# EasyEDA Pro project 主控底板.eprj

# Schematic TMS320F28335

## Sheets
1 coreboard: Board Name: TMS320F28335
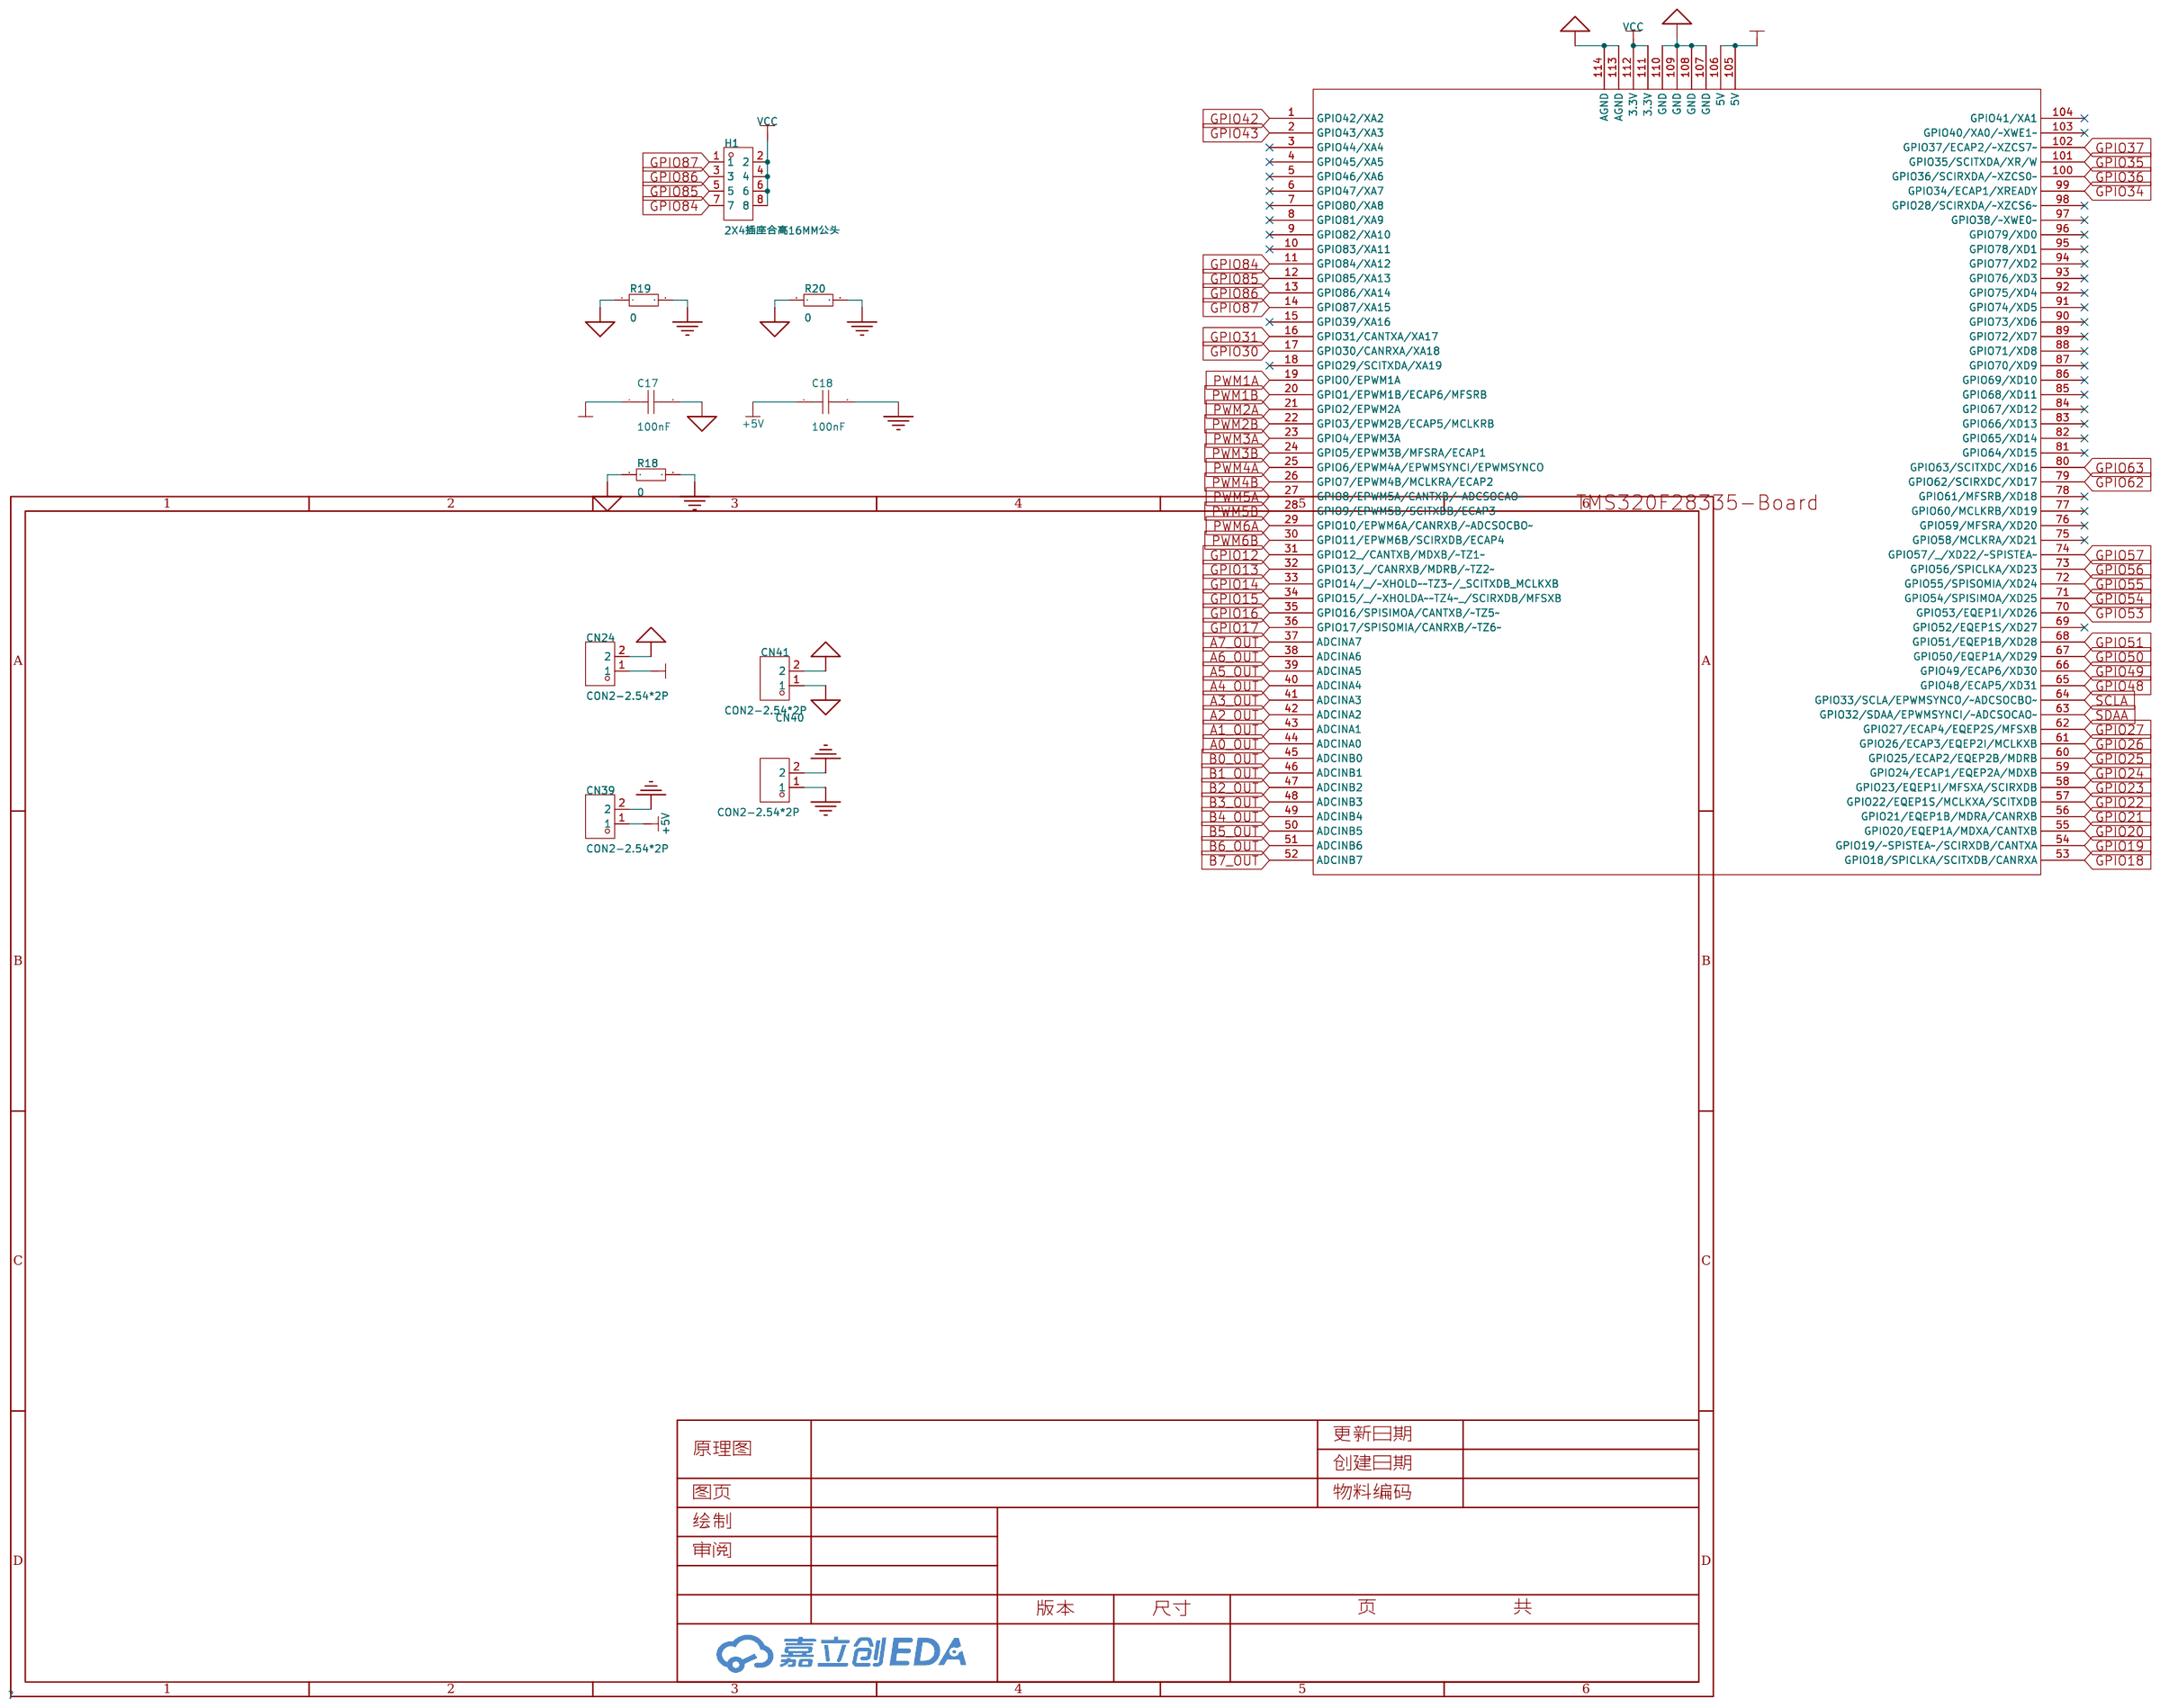
[diagram p0: coreboard]
2 adc: Create Date: 2025-05-22
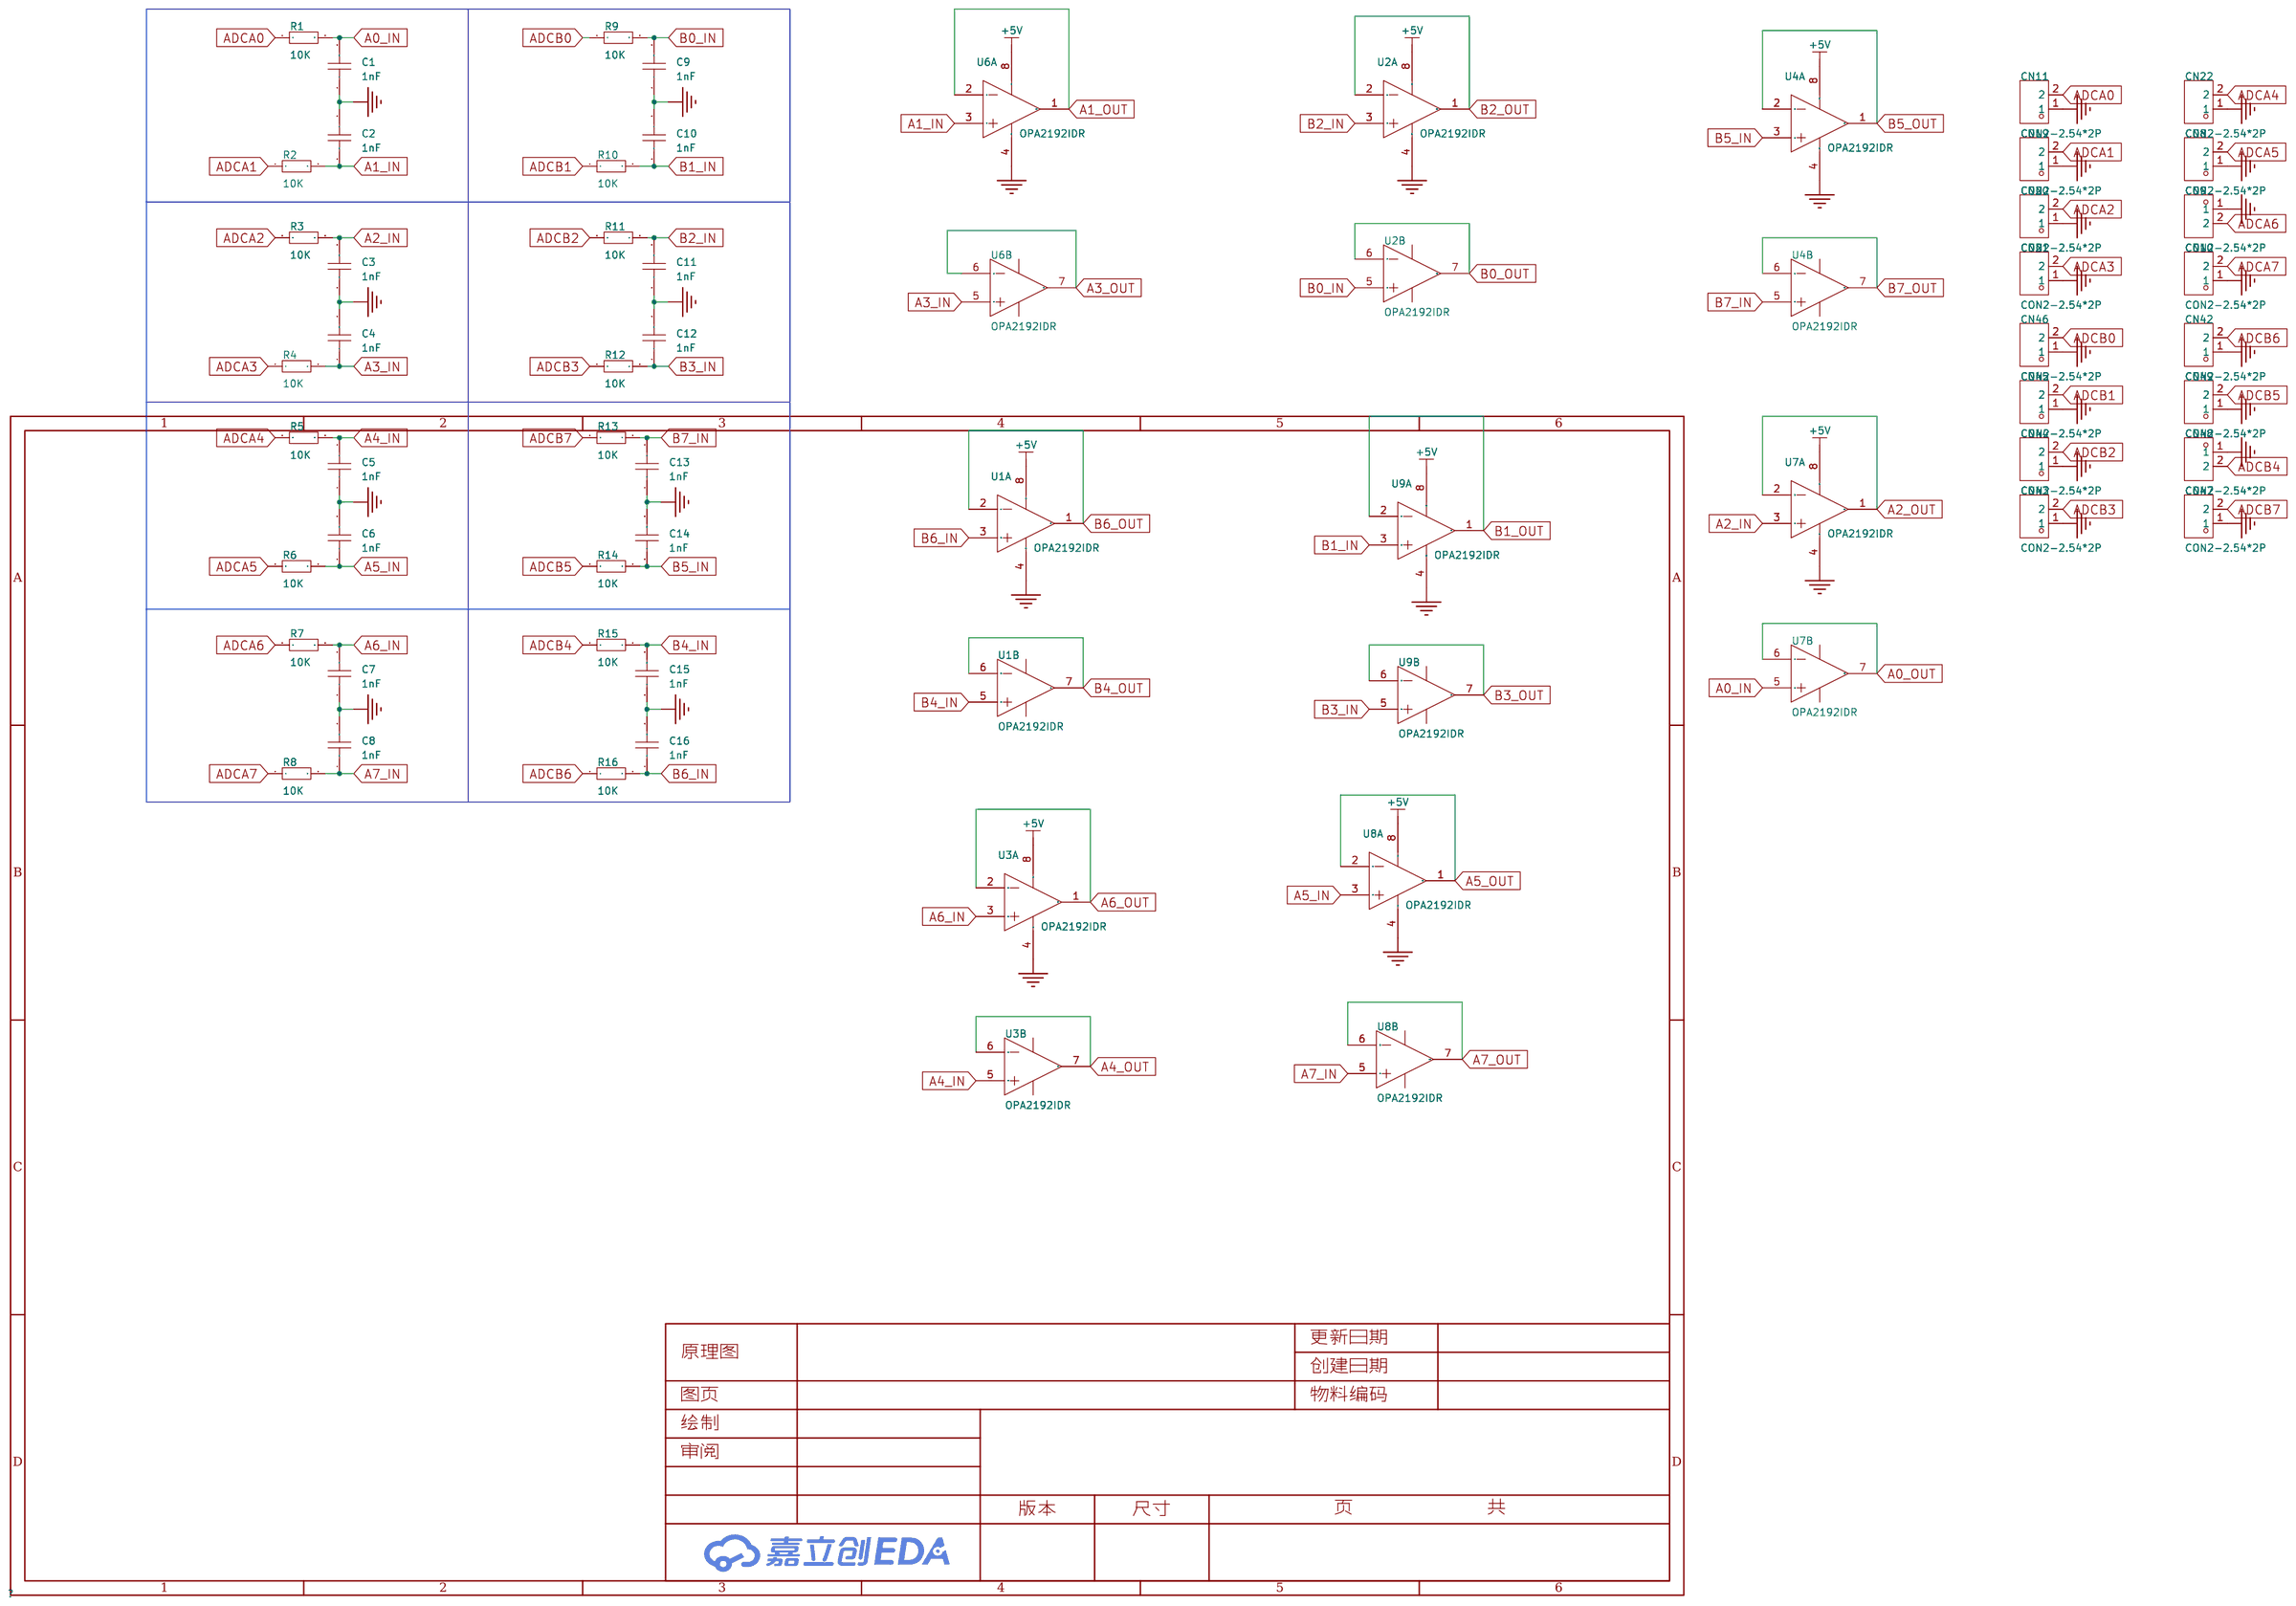
[diagram p1: adc]
3 gpio: Create Date: 2025-05-22
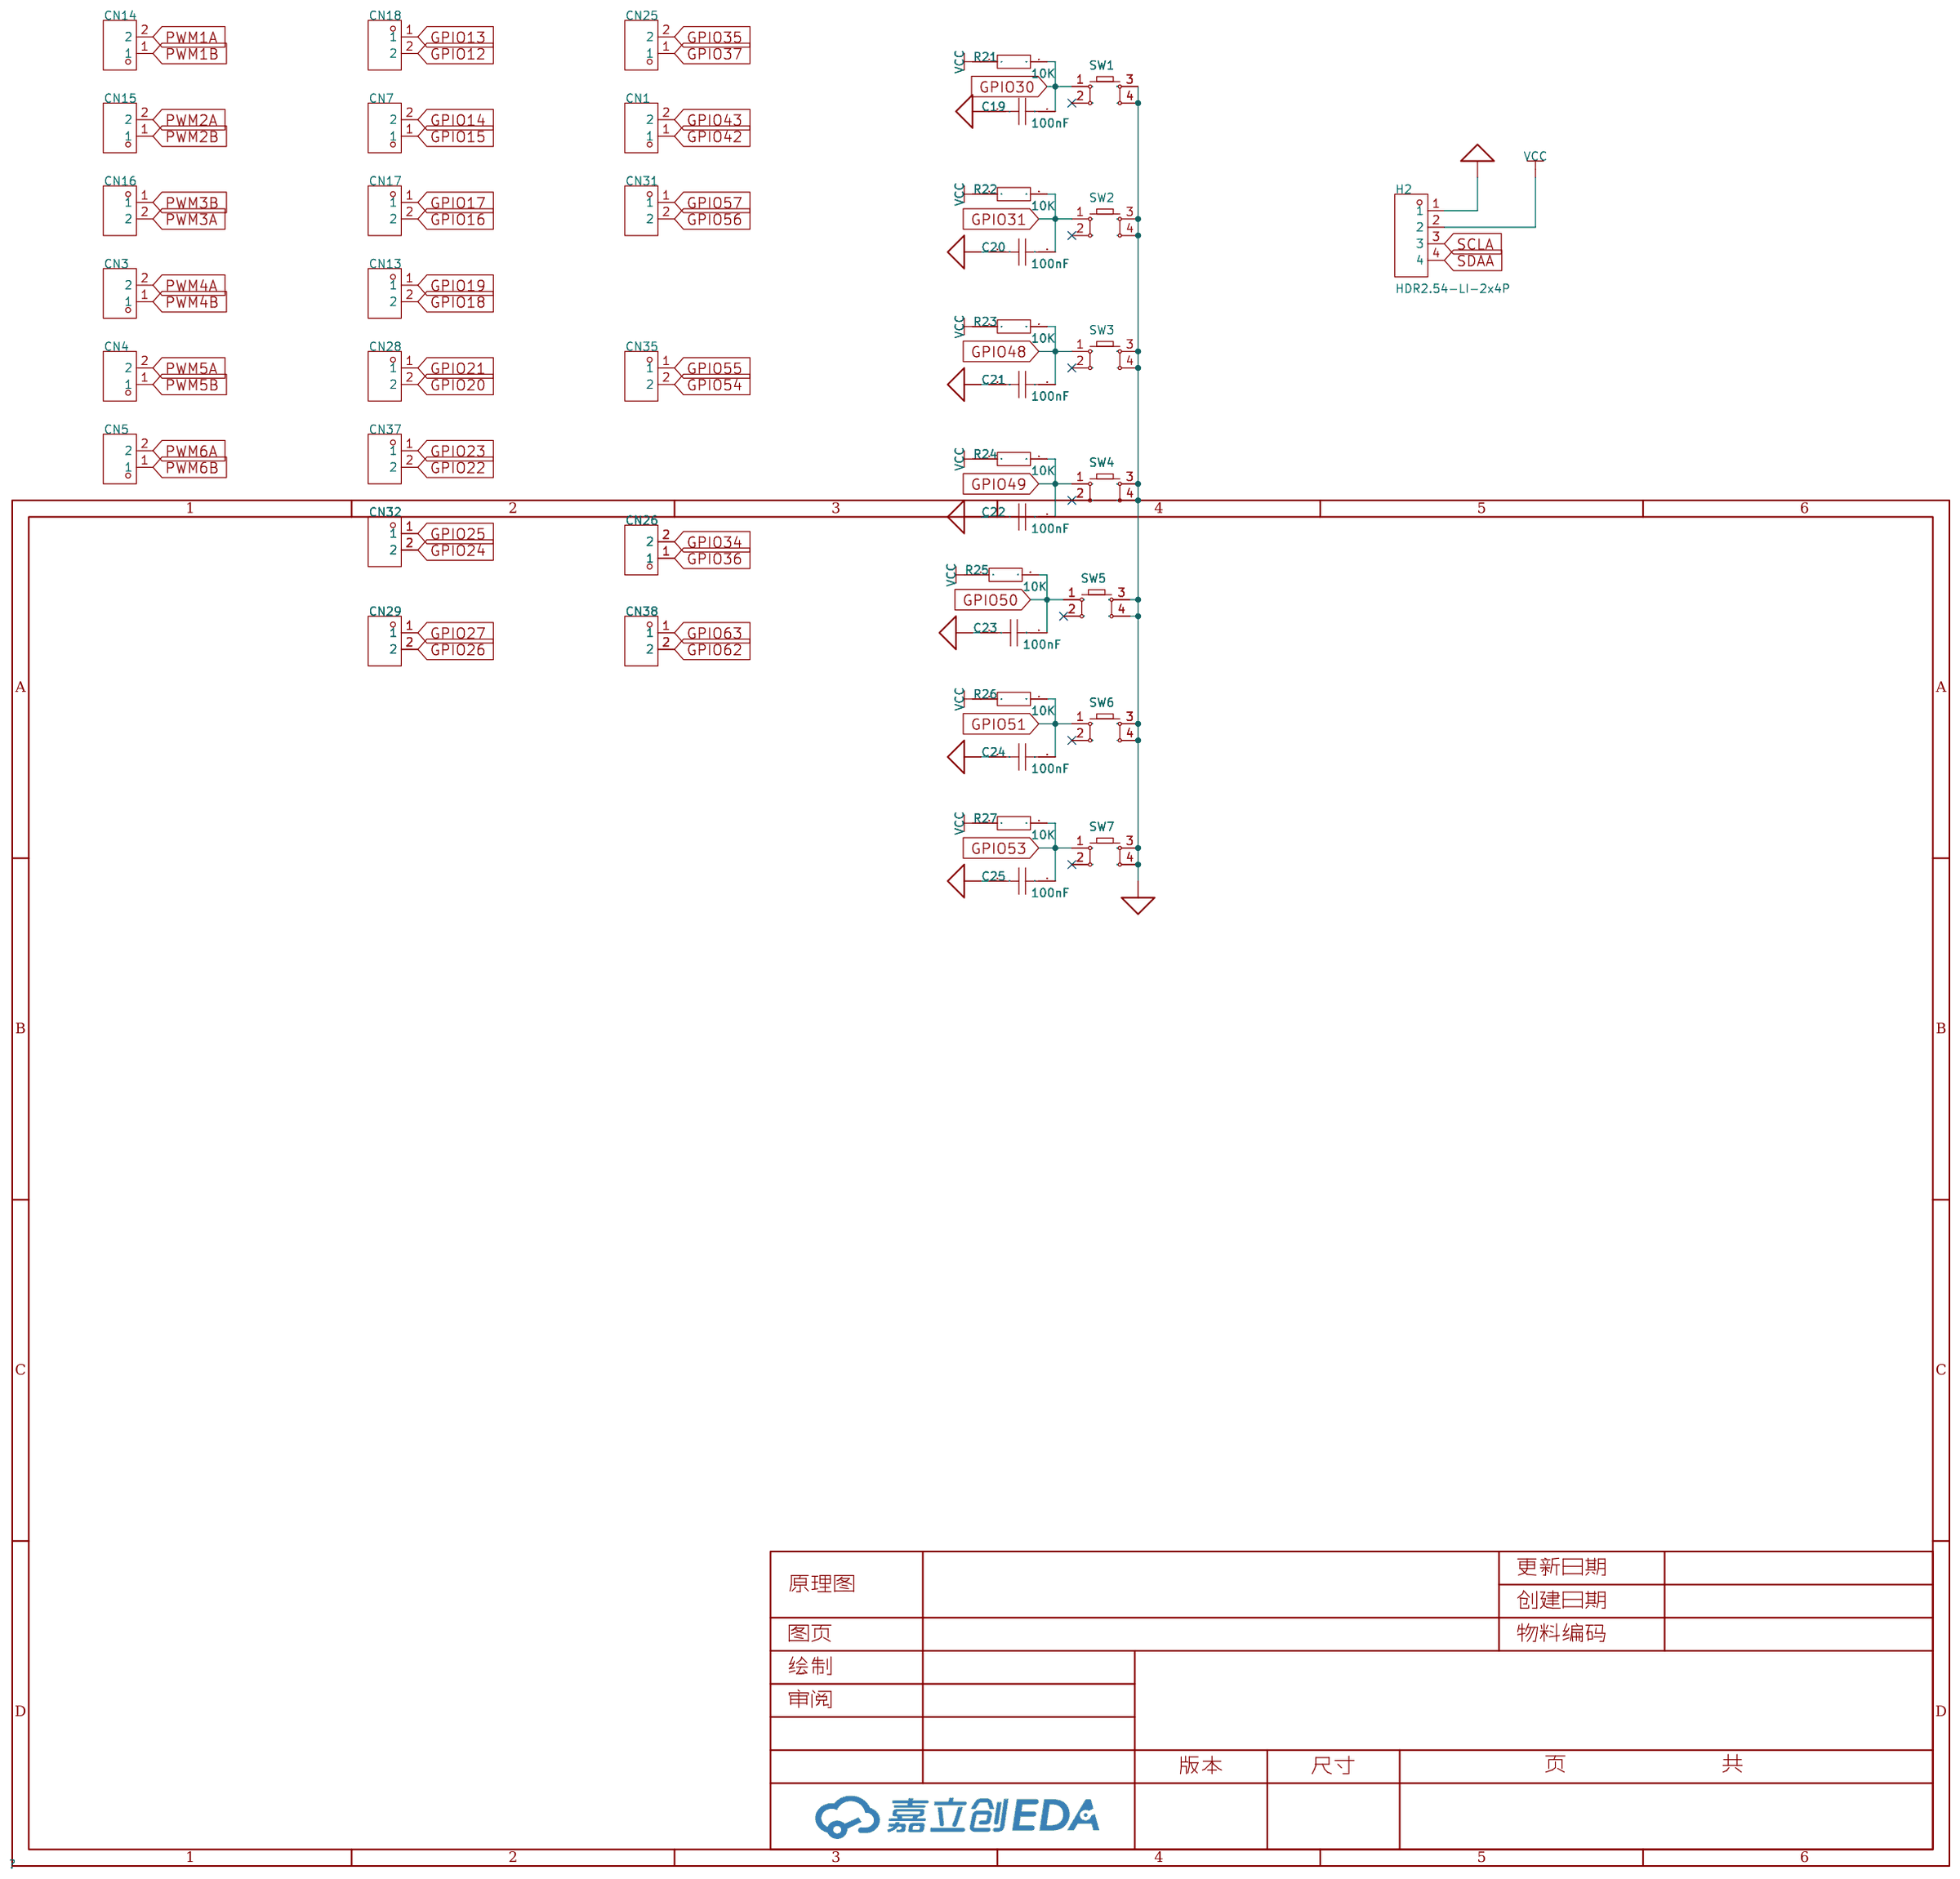
[diagram p2: gpio]

## Parts
sheet adc
C1  1nF  [C0805]
C2  1nF  [C0805]
C3  1nF  [C0805]
C4  1nF  [C0805]
C5  1nF  [C0805]
C6  1nF  [C0805]
C7  1nF  [C0805]
C8  1nF  [C0805]
C9  1nF  [C0805]
C10  1nF  [C0805]
C11  1nF  [C0805]
C12  1nF  [C0805]
C13  1nF  [C0805]
C14  1nF  [C0805]
C15  1nF  [C0805]
C16  1nF  [C0805]
CN8  CON2-2.54*2P  [CONN-TH_2P-P2.54-V]
CN9  CON2-2.54*2P  [CONN-TH_2P-P2.54-V]
CN10  CON2-2.54*2P  [CONN-TH_2P-P2.54-V]
CN11  CON2-2.54*2P  [CONN-TH_2P-P2.54-V]
CN19  CON2-2.54*2P  [CONN-TH_2P-P2.54-V]
CN20  CON2-2.54*2P  [CONN-TH_2P-P2.54-V]
CN21  CON2-2.54*2P  [CONN-TH_2P-P2.54-V]
CN22  CON2-2.54*2P  [CONN-TH_2P-P2.54-V]
CN42  CON2-2.54*2P  [CONN-TH_2P-P2.54-V]
CN43  CON2-2.54*2P  [CONN-TH_2P-P2.54-V]
CN44  CON2-2.54*2P  [CONN-TH_2P-P2.54-V]
CN45  CON2-2.54*2P  [CONN-TH_2P-P2.54-V]
CN46  CON2-2.54*2P  [CONN-TH_2P-P2.54-V]
CN47  CON2-2.54*2P  [CONN-TH_2P-P2.54-V]
CN48  CON2-2.54*2P  [CONN-TH_2P-P2.54-V]
CN49  CON2-2.54*2P  [CONN-TH_2P-P2.54-V]
R1  10K  [R0805]
R2  10K  [R0805]
R3  10K  [R0805]
R4  10K  [R0805]
R5  10K  [R0805]
R6  10K  [R0805]
R7  10K  [R0805]
R8  10K  [R0805]
R9  10K  [R0805]
R10  10K  [R0805]
R11  10K  [R0805]
R12  10K  [R0805]
R13  10K  [R0805]
R14  10K  [R0805]
R15  10K  [R0805]
R16  10K  [R0805]
U1  OPA2192IDR  [SOIC-8_L4.9-W3.9-P1.27-LS6.0-BL]  (sections 1,2)
U2  OPA2192IDR  [SOIC-8_L4.9-W3.9-P1.27-LS6.0-BL]  (sections 1,2)
U3  OPA2192IDR  [SOIC-8_L4.9-W3.9-P1.27-LS6.0-BL]  (sections 1,2)
U4  OPA2192IDR  [SOIC-8_L4.9-W3.9-P1.27-LS6.0-BL]  (sections 1,2)
U6  OPA2192IDR  [SOIC-8_L4.9-W3.9-P1.27-LS6.0-BL]  (sections 1,2)
U7  OPA2192IDR  [SOIC-8_L4.9-W3.9-P1.27-LS6.0-BL]  (sections 1,2)
U8  OPA2192IDR  [SOIC-8_L4.9-W3.9-P1.27-LS6.0-BL]  (sections 1,2)
U9  OPA2192IDR  [SOIC-8_L4.9-W3.9-P1.27-LS6.0-BL]  (sections 1,2)
sheet coreboard
C17  100nF  [C0805]
C18  100nF  [C0805]
CN24  CON2-2.54*2P  [CONN-TH_2P-P2.54-V]
CN39  CON2-2.54*2P  [CONN-TH_2P-P2.54-V]
CN40  CON2-2.54*2P  [CONN-TH_2P-P2.54-V]
CN41  CON2-2.54*2P  [CONN-TH_2P-P2.54-V]
H1  2X4插座合高16MM公头  [HDR-TH_8P-P2.54-V-M-R2-C4-S2.54-2]
R18  0  [R0805]
R19  0  [R0805]
R20  0  [R0805]
TMS320F?#1  TMS320F28335_Board  [TMS320F28335]
sheet gpio
C19  100nF  [C0805]
C20  100nF  [C0805]
C21  100nF  [C0805]
C22  100nF  [C0805]
C23  100nF  [C0805]
C24  100nF  [C0805]
C25  100nF  [C0805]
CN1  CON2-2.54*2P  [CONN-TH_2P-P2.54-V]
CN3  CON2-2.54*2P  [CONN-TH_2P-P2.54-V]
CN4  CON2-2.54*2P  [CONN-TH_2P-P2.54-V]
CN5  CON2-2.54*2P  [CONN-TH_2P-P2.54-V]
CN7  CON2-2.54*2P  [CONN-TH_2P-P2.54-V]
CN13  CON2-2.54*2P  [CONN-TH_2P-P2.54-V]
CN14  CON2-2.54*2P  [CONN-TH_2P-P2.54-V]
CN15  CON2-2.54*2P  [CONN-TH_2P-P2.54-V]
CN16  CON2-2.54*2P  [CONN-TH_2P-P2.54-V]
CN17  CON2-2.54*2P  [CONN-TH_2P-P2.54-V]
CN18  CON2-2.54*2P  [CONN-TH_2P-P2.54-V]
CN25  CON2-2.54*2P  [CONN-TH_2P-P2.54-V]
CN26  CON2-2.54*2P  [CONN-TH_2P-P2.54-V]
CN28  CON2-2.54*2P  [CONN-TH_2P-P2.54-V]
CN29  CON2-2.54*2P  [CONN-TH_2P-P2.54-V]
CN31  CON2-2.54*2P  [CONN-TH_2P-P2.54-V]
CN32  CON2-2.54*2P  [CONN-TH_2P-P2.54-V]
CN35  CON2-2.54*2P  [CONN-TH_2P-P2.54-V]
CN37  CON2-2.54*2P  [CONN-TH_2P-P2.54-V]
CN38  CON2-2.54*2P  [CONN-TH_2P-P2.54-V]
H2  HDR2.54-LI-2x4P  [HDR-TH_4P-P2.54-V-M]
R21  10K  [R0805]
R22  10K  [R0805]
R23  10K  [R0805]
R24  10K  [R0805]
R25  10K  [R0805]
R26  10K  [R0805]
R27  10K  [R0805]
SW1  -  [SW-SMD_4P-L6.0-W6.0-P4.50-LS9.0-2]
SW2  -  [SW-SMD_4P-L6.0-W6.0-P4.50-LS9.0-2]
SW3  -  [SW-SMD_4P-L6.0-W6.0-P4.50-LS9.0-2]
SW4  -  [SW-SMD_4P-L6.0-W6.0-P4.50-LS9.0-2]
SW5  -  [SW-SMD_4P-L6.0-W6.0-P4.50-LS9.0-2]
SW6  -  [SW-SMD_4P-L6.0-W6.0-P4.50-LS9.0-2]
SW7  -  [SW-SMD_4P-L6.0-W6.0-P4.50-LS9.0-2]

## Library data of the parts
C1-C25 = CAP_0805: Supplier Footprint: 0805
CN1 CN3-CN5 CN7-CN11 CN13-CN22 CN24-CN26 CN28 CN29 CN31 CN32 CN35 CN37-CN49 = CON2-2.54*2P: Supplier Part: C9900003238; Supplier Footprint: TH-2P; JLCPCB Part Class: Extended Part; Supplier: LCSC
R1-R16 R18-R27 = Res_0805: Supplier Footprint: 0805
U1-U4 U6-U9 = OPA2192IDR: 放大器数:双路;增益带宽积(GBP):10MHz;输入偏置电流(Ib):5pA;输入失调电压(Vos):-;压摆率(SR):20V/us;带宽(-3db):-;轨到轨:轨到轨输入输出;; Supplier Part: C110074; Manufacturer: TI(德州仪器); Supplier Footprint: SOIC-8; JLCPCB Part Class: 扩展库; Datasheet: https://www.ti.com/cn/lit/gpn/opa2192; Supplier: LCSC; Number of Circuits: 双路; Gain Bandwidth Product(GBP): 10MHz; Current - Input Bias(Ib): 5pA; Slew Rate(SR): 20V/us; Output Current: 65mA; Rail to Rail: 轨到轨输入输出; Supply Current: 1mA; Operating Temperature: -40℃~+125℃
H1 = 2X4插座合高16MM公头: Supplier Part: C9900022742; Supplier Footprint: HDR-TH_8P-P2.54-V-M; JLCPCB Part Class: 扩展库; Supplier: LCSC
TMS320F?#1 = TMS320F28335_Board
H2 = HDR2.54-LI-2x4P: Supplier Part: C9900020145; JLCPCB Part Class: 扩展库; Supplier: LCSC
SW1-SW7 = Key_SMD_6x6x6.5: Supplier Footprint: SMD

## Nets
+5V: C18.1 CN39.1 U1.8(VDD) U2.8(VDD) U3.8(VDD) U4.8(VDD) U6.8(VDD) U7.8(VDD) U8.8(VDD) U9.8(VDD)
+5V_D: C17.1 CN24.1 TMS320F?#1.105(5V) TMS320F?#1.106(5V)
AGND: C17.2 C19.1 C20.1 C21.1 C22.1 C23.1 C24.1 C25.1 CN24.2 CN41.1 CN41.2 H2.1 R18.1 R19.1 R20.1 SW1.3 SW1.4 SW2.3 SW2.4 SW3.3 SW3.4 SW4.3 SW4.4 SW5.3 SW5.4 SW6.3 SW6.4 SW7.3 SW7.4 TMS320F?#1.107(GND) TMS320F?#1.108(GND) TMS320F?#1.109(GND) TMS320F?#1.110(GND) TMS320F?#1.113(AGND) TMS320F?#1.114(AGND)
GND: C1.1 C2.2 C3.1 C4.2 C5.1 C6.2 C7.1 C8.2 C9.1 C10.2 C11.1 C12.2 C13.1 C14.2 C15.1 C16.2 C18.2 CN8.1 CN9.1 CN10.1 CN11.1 CN19.1 CN20.1 CN21.1 CN22.1 CN39.2 CN40.1 CN40.2 CN42.1 CN43.1 CN44.1 CN45.1 CN46.1 CN47.1 CN48.1 CN49.1 R18.2 R19.2 R20.2 U1.4(VSS) U2.4(VSS) U3.4(VSS) U4.4(VSS) U6.4(VSS) U7.4(VSS) U8.4(VSS) U9.4(VSS)
VCC: H1.2 H1.4 H1.6 H1.8 H2.2 R21.1 R22.1 R23.1 R24.1 R25.1 R26.1 R27.1 TMS320F?#1.111(3.3V) TMS320F?#1.112(3.3V)
A0_IN: C1.2 R1.2 U7.5(VINB+)
A0_OUT: TMS320F?#1.44(ADCINA0) U7.6(VINB-) U7.7(VOUTB)
A1_IN: C2.1 R2.2 U6.3(VINA+)
A1_OUT: TMS320F?#1.43(ADCINA1) U6.1(VOUTA) U6.2(VINA-)
A2_IN: C3.2 R3.2 U7.3(VINA+)
A2_OUT: TMS320F?#1.42(ADCINA2) U7.1(VOUTA) U7.2(VINA-)
A3_IN: C4.1 R4.2 U6.5(VINB+)
A3_OUT: TMS320F?#1.41(ADCINA3) U6.6(VINB-) U6.7(VOUTB)
A4_IN: C5.2 R5.2 U3.5(VINB+)
A4_OUT: TMS320F?#1.40(ADCINA4) U3.6(VINB-) U3.7(VOUTB)
A5_IN: C6.1 R6.2 U8.3(VINA+)
A5_OUT: TMS320F?#1.39(ADCINA5) U8.1(VOUTA) U8.2(VINA-)
A6_IN: C7.2 R7.2 U3.3(VINA+)
A6_OUT: TMS320F?#1.38(ADCINA6) U3.1(VOUTA) U3.2(VINA-)
A7_IN: C8.1 R8.2 U8.5(VINB+)
A7_OUT: TMS320F?#1.37(ADCINA7) U8.6(VINB-) U8.7(VOUTB)
ADCA0: CN11.2 R1.1
ADCA1: CN19.2 R2.1
ADCA2: CN20.2 R3.1
ADCA3: CN21.2 R4.1
ADCA4: CN22.2 R5.1
ADCA5: CN8.2 R6.1
ADCA6: CN9.2 R7.1
ADCA7: CN10.2 R8.1
ADCB0: CN46.2 R9.1
ADCB1: CN45.2 R10.1
ADCB2: CN44.2 R11.1
ADCB3: CN43.2 R12.1
ADCB4: CN48.2 R15.1
ADCB5: CN49.2 R14.1
ADCB6: CN42.2 R16.1
ADCB7: CN47.2 R13.1
B0_IN: C9.2 R9.2 U2.5(VINB+)
B0_OUT: TMS320F?#1.45(ADCINB0) U2.6(VINB-) U2.7(VOUTB)
B1_IN: C10.1 R10.2 U9.3(VINA+)
B1_OUT: TMS320F?#1.46(ADCINB1) U9.1(VOUTA) U9.2(VINA-)
B2_IN: C11.2 R11.2 U2.3(VINA+)
B2_OUT: TMS320F?#1.47(ADCINB2) U2.1(VOUTA) U2.2(VINA-)
B3_IN: C12.1 R12.2 U9.5(VINB+)
B3_OUT: TMS320F?#1.48(ADCINB3) U9.6(VINB-) U9.7(VOUTB)
B4_IN: C15.2 R15.2 U1.5(VINB+)
B4_OUT: TMS320F?#1.49(ADCINB4) U1.6(VINB-) U1.7(VOUTB)
B5_IN: C14.1 R14.2 U4.3(VINA+)
B5_OUT: TMS320F?#1.50(ADCINB5) U4.1(VOUTA) U4.2(VINA-)
B6_IN: C16.1 R16.2 U1.3(VINA+)
B6_OUT: TMS320F?#1.51(ADCINB6) U1.1(VOUTA) U1.2(VINA-)
B7_IN: C13.2 R13.2 U4.5(VINB+)
B7_OUT: TMS320F?#1.52(ADCINB7) U4.6(VINB-) U4.7(VOUTB)
GPIO12: CN18.2 TMS320F?#1.31(GPIO12 /CANTXB/MDXB/~TZ1~)
GPIO13: CN18.1 TMS320F?#1.32(GPIO13/ /CANRXB/MDRB/~TZ2~)
GPIO14: CN7.2 TMS320F?#1.33(GPIO14/ /~XHOLD~~TZ3~/ SCITXDB MCLKXB)
GPIO15: CN7.1 TMS320F?#1.34(GPIO15/ /~XHOLDA~~TZ4~ /SCIRXDB/MFSXB)
GPIO16: CN17.2 TMS320F?#1.35(GPIO16/SPISIMOA/CANTXB/~TZ5~)
GPIO17: CN17.1 TMS320F?#1.36(GPIO17/SPISOMIA/CANRXB/~TZ6~)
GPIO18: CN13.2 TMS320F?#1.53(GPIO18/SPICLKA/SCITXDB/CANRXA)
GPIO19: CN13.1 TMS320F?#1.54(GPIO19/~SPISTEA~/SCIRXDB/CANTXA)
GPIO20: CN28.2 TMS320F?#1.55(GPIO20/EQEP1A/MDXA/CANTXB)
GPIO21: CN28.1 TMS320F?#1.56(GPIO21/EQEP1B/MDRA/CANRXB)
GPIO22: CN37.2 TMS320F?#1.57(GPIO22/EQEP1S/MCLKXA/SCITXDB)
GPIO23: CN37.1 TMS320F?#1.58(GPIO23/EQEP1I/MFSXA/SCIRXDB)
GPIO24: CN32.2 TMS320F?#1.59(GPIO24/ECAP1/EQEP2A/MDXB)
GPIO25: CN32.1 TMS320F?#1.60(GPIO25/ECAP2/EQEP2B/MDRB)
GPIO26: CN29.2 TMS320F?#1.61(GPIO26/ECAP3/EQEP2I/MCLKXB)
GPIO27: CN29.1 TMS320F?#1.62(GPIO27/ECAP4/EQEP2S/MFSXB)
GPIO30: C19.2 R21.2 SW1.1 TMS320F?#1.17(GPIO30/CANRXA/XA18)
GPIO31: C20.2 R22.2 SW2.1 TMS320F?#1.16(GPIO31/CANTXA/XA17)
GPIO34: CN26.2 TMS320F?#1.99(GPIO34/ECAP1/XREADY)
GPIO35: CN25.2 TMS320F?#1.101(GPIO35/SCITXDA/XR/W)
GPIO36: CN26.1 TMS320F?#1.100(GPIO36/SCIRXDA/~XZCS0~)
GPIO37: CN25.1 TMS320F?#1.102(GPIO37/ECAP2/~XZCS7~)
GPIO42: CN1.1 TMS320F?#1.1(GPIO42/XA2)
GPIO43: CN1.2 TMS320F?#1.2(GPIO43/XA3)
GPIO48: C21.2 R23.2 SW3.1 TMS320F?#1.65(GPIO48/ECAP5/XD31)
GPIO49: C22.2 R24.2 SW4.1 TMS320F?#1.66(GPIO49/ECAP6/XD30)
GPIO50: C23.2 R25.2 SW5.1 TMS320F?#1.67(GPIO50/EQEP1A/XD29)
GPIO51: C24.2 R26.2 SW6.1 TMS320F?#1.68(GPIO51/EQEP1B/XD28)
GPIO53: C25.2 R27.2 SW7.1 TMS320F?#1.70(GPIO53/EQEP1I/XD26)
GPIO54: CN35.2 TMS320F?#1.71(GPIO54/SPISIMOA/XD25)
GPIO55: CN35.1 TMS320F?#1.72(GPIO55/SPISOMIA/XD24)
GPIO56: CN31.2 TMS320F?#1.73(GPIO56/SPICLKA/XD23)
GPIO57: CN31.1 TMS320F?#1.74(GPIO57/ /XD22/~SPISTEA~)
GPIO62: CN38.2 TMS320F?#1.79(GPIO62/SCIRXDC/XD17)
GPIO63: CN38.1 TMS320F?#1.80(GPIO63/SCITXDC/XD16)
GPIO84: H1.7 TMS320F?#1.11(GPIO84/XA12)
GPIO85: H1.5 TMS320F?#1.12(GPIO85/XA13)
GPIO86: H1.3 TMS320F?#1.13(GPIO86/XA14)
GPIO87: H1.1 TMS320F?#1.14(GPIO87/XA15)
PWM1A: CN14.2 TMS320F?#1.19(GPIO0/EPWM1A)
PWM1B: CN14.1 TMS320F?#1.20(GPIO1/EPWM1B/ECAP6/MFSRB)
PWM2A: CN15.2 TMS320F?#1.21(GPIO2/EPWM2A)
PWM2B: CN15.1 TMS320F?#1.22(GPIO3/EPWM2B/ECAP5/MCLKRB)
PWM3A: CN16.2 TMS320F?#1.23(GPIO4/EPWM3A)
PWM3B: CN16.1 TMS320F?#1.24(GPIO5/EPWM3B/MFSRA/ECAP1)
PWM4A: CN3.2 TMS320F?#1.25(GPIO6/EPWM4A/EPWMSYNCI/EPWMSYNCO)
PWM4B: CN3.1 TMS320F?#1.26(GPIO7/EPWM4B/MCLKRA/ECAP2)
PWM5A: CN4.2 TMS320F?#1.27(GPIO8/EPWM5A/CANTXB/~ADCSOCAO~)
PWM5B: CN4.1 TMS320F?#1.28(GPIO9/EPWM5B/SCITXDB/ECAP3)
PWM6A: CN5.2 TMS320F?#1.29(GPIO10/EPWM6A/CANRXB/~ADCSOCBO~)
PWM6B: CN5.1 TMS320F?#1.30(GPIO11/EPWM6B/SCIRXDB/ECAP4)
SCLA: H2.3 TMS320F?#1.64(GPIO33/SCLA/EPWMSYNCO/~ADCSOCBO~)
SDAA: H2.4 TMS320F?#1.63(GPIO32/SDAA/EPWMSYNCI/~ADCSOCAO~)

Not connected (* = marked no-connect by the designer): SW1 2*; SW2 2*; SW3 2*; SW4 2*; SW5 2*; SW6 2*; SW7 2*; TMS320F?#1 3(GPIO44/XA4)* 4(GPIO45/XA5)* 5(GPIO46/XA6)* 6(GPIO47/XA7)* 7(GPIO80/XA8)* 8(GPIO81/XA9)* 9(GPIO82/XA10)* 10(GPIO83/XA11)* 15(GPIO39/XA16)* 18(GPIO29/SCITXDA/XA19)* 69(GPIO52/EQEP1S/XD27)* 75(GPIO58/MCLKRA/XD21)* 76(GPIO59/MFSRA/XD20)* 77(GPIO60/MCLKRB/XD19)* 78(GPIO61/MFSRB/XD18)* 81(GPIO64/XD15)* 82(GPIO65/XD14)* 83(GPIO66/XD13)* 84(GPIO67/XD12)* 85(GPIO68/XD11)* 86(GPIO69/XD10)* 87(GPIO70/XD9)* 88(GPIO71/XD8)* 89(GPIO72/XD7)* 90(GPIO73/XD6)* 91(GPIO74/XD5)* 92(GPIO75/XD4)* 93(GPIO76/XD3)* 94(GPIO77/XD2)* 95(GPIO78/XD1)* 96(GPIO79/XD0)* 97(GPIO38/~XWE0~)* 98(GPIO28/SCIRXDA/~XZCS6~)* 103(GPIO40/XA0/~XWE1~)* 104(GPIO41/XA1)*

# Board TMS320F28335
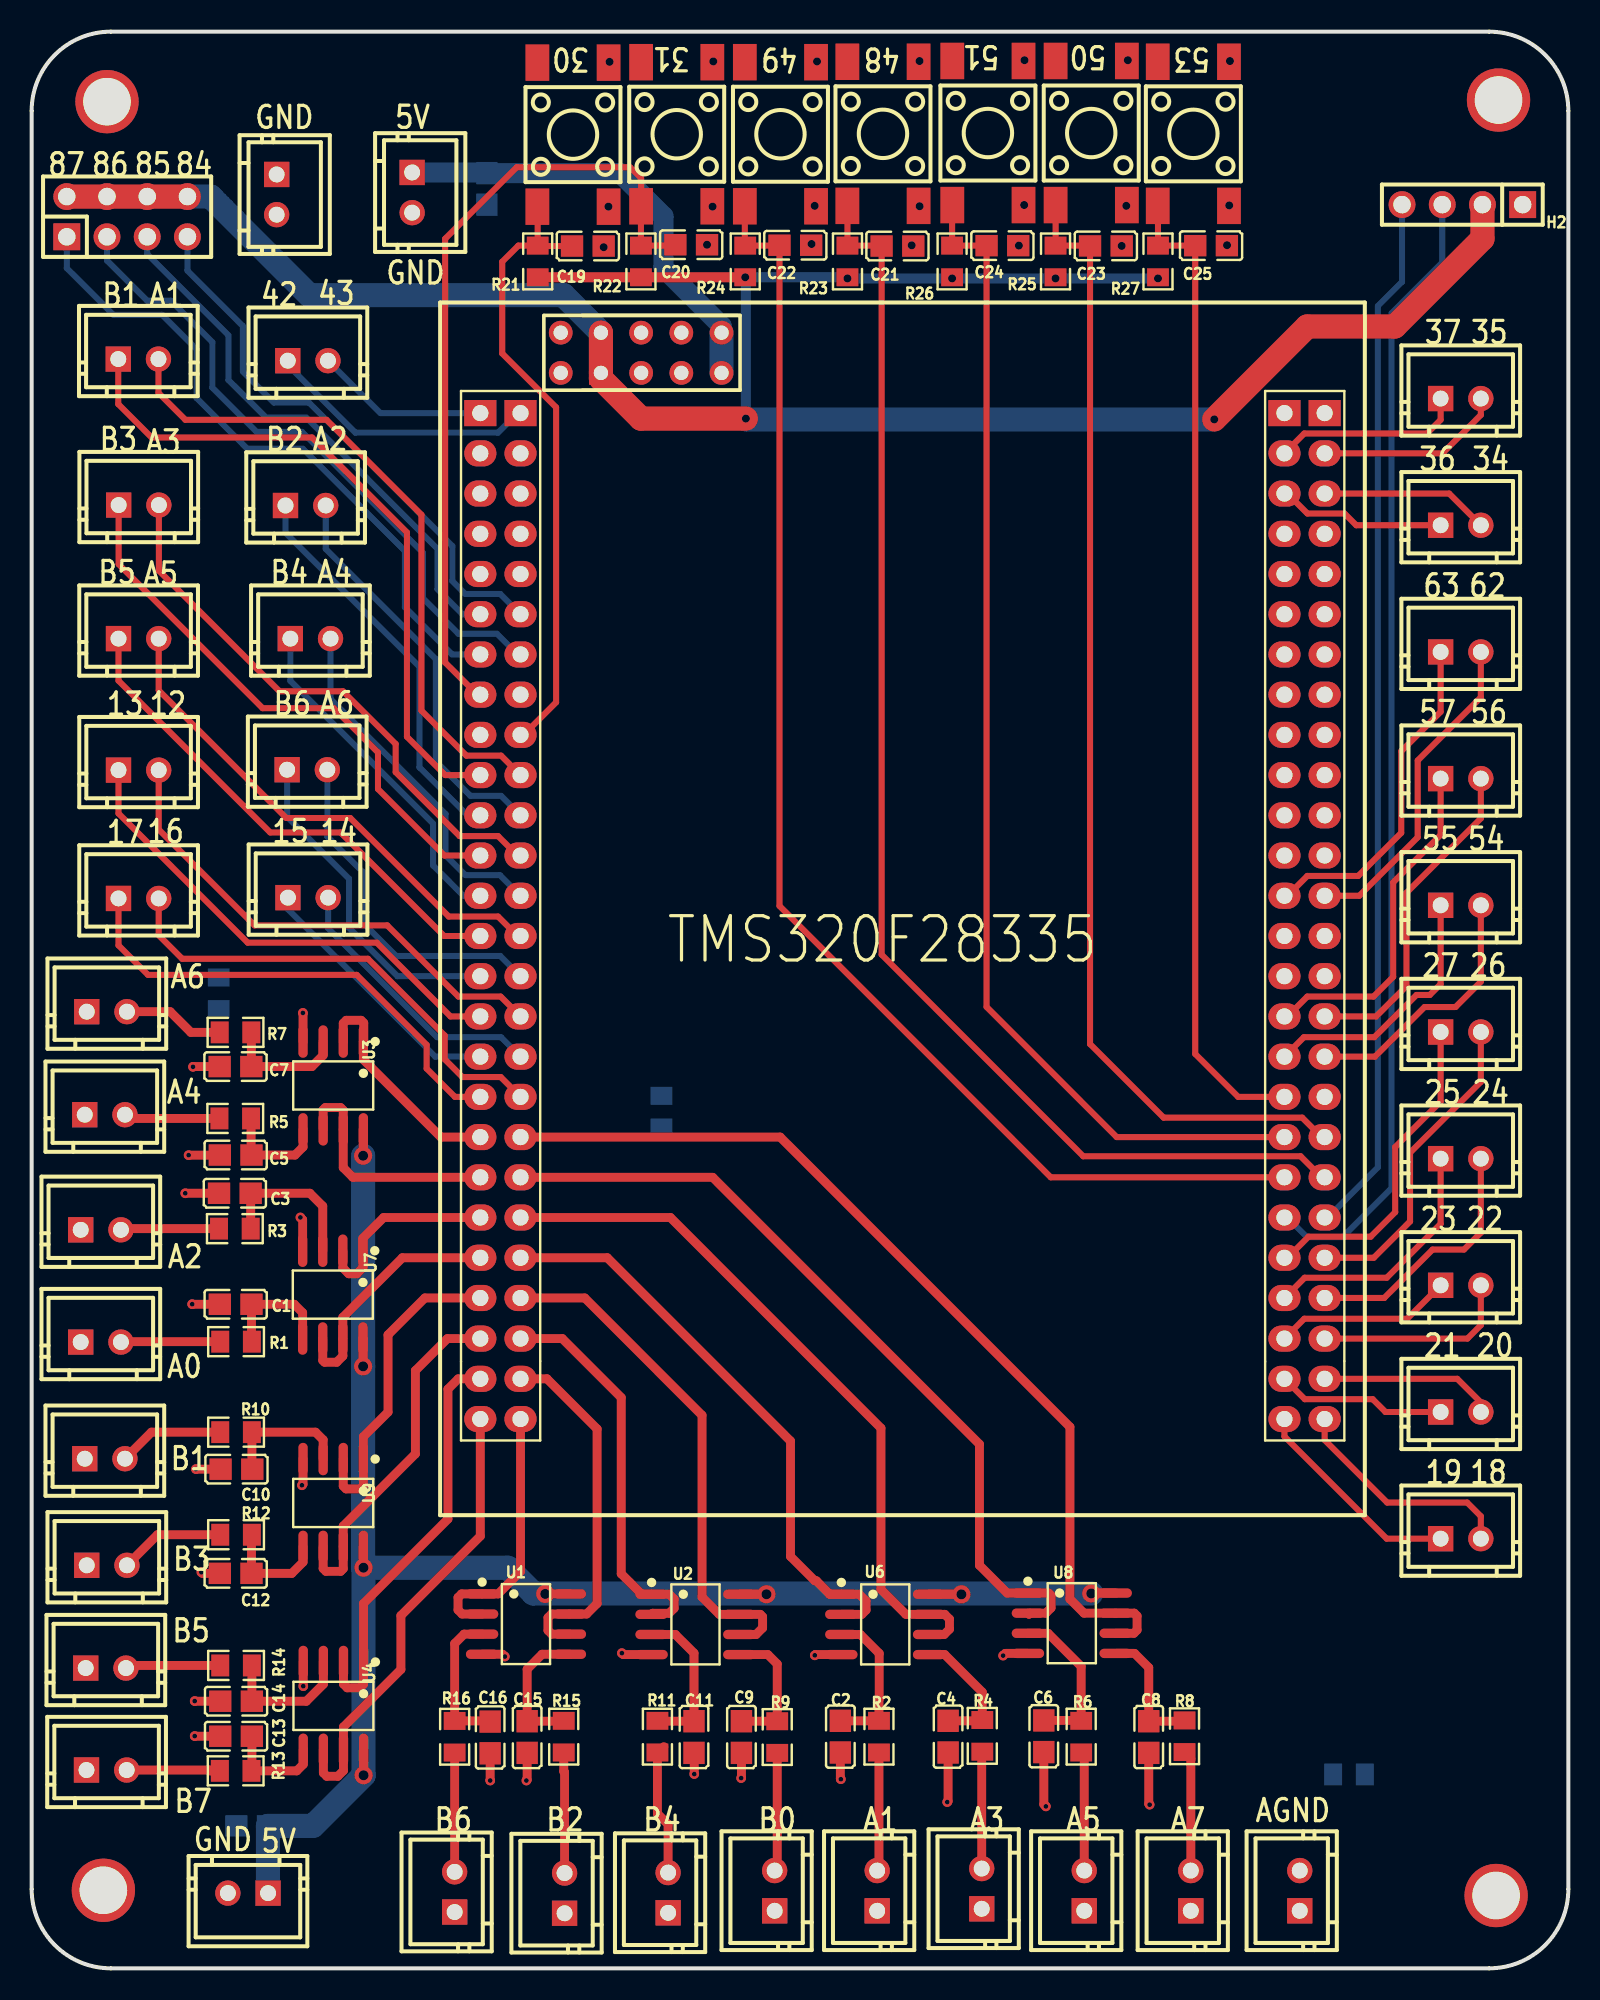
[diagram p3: board, top side]
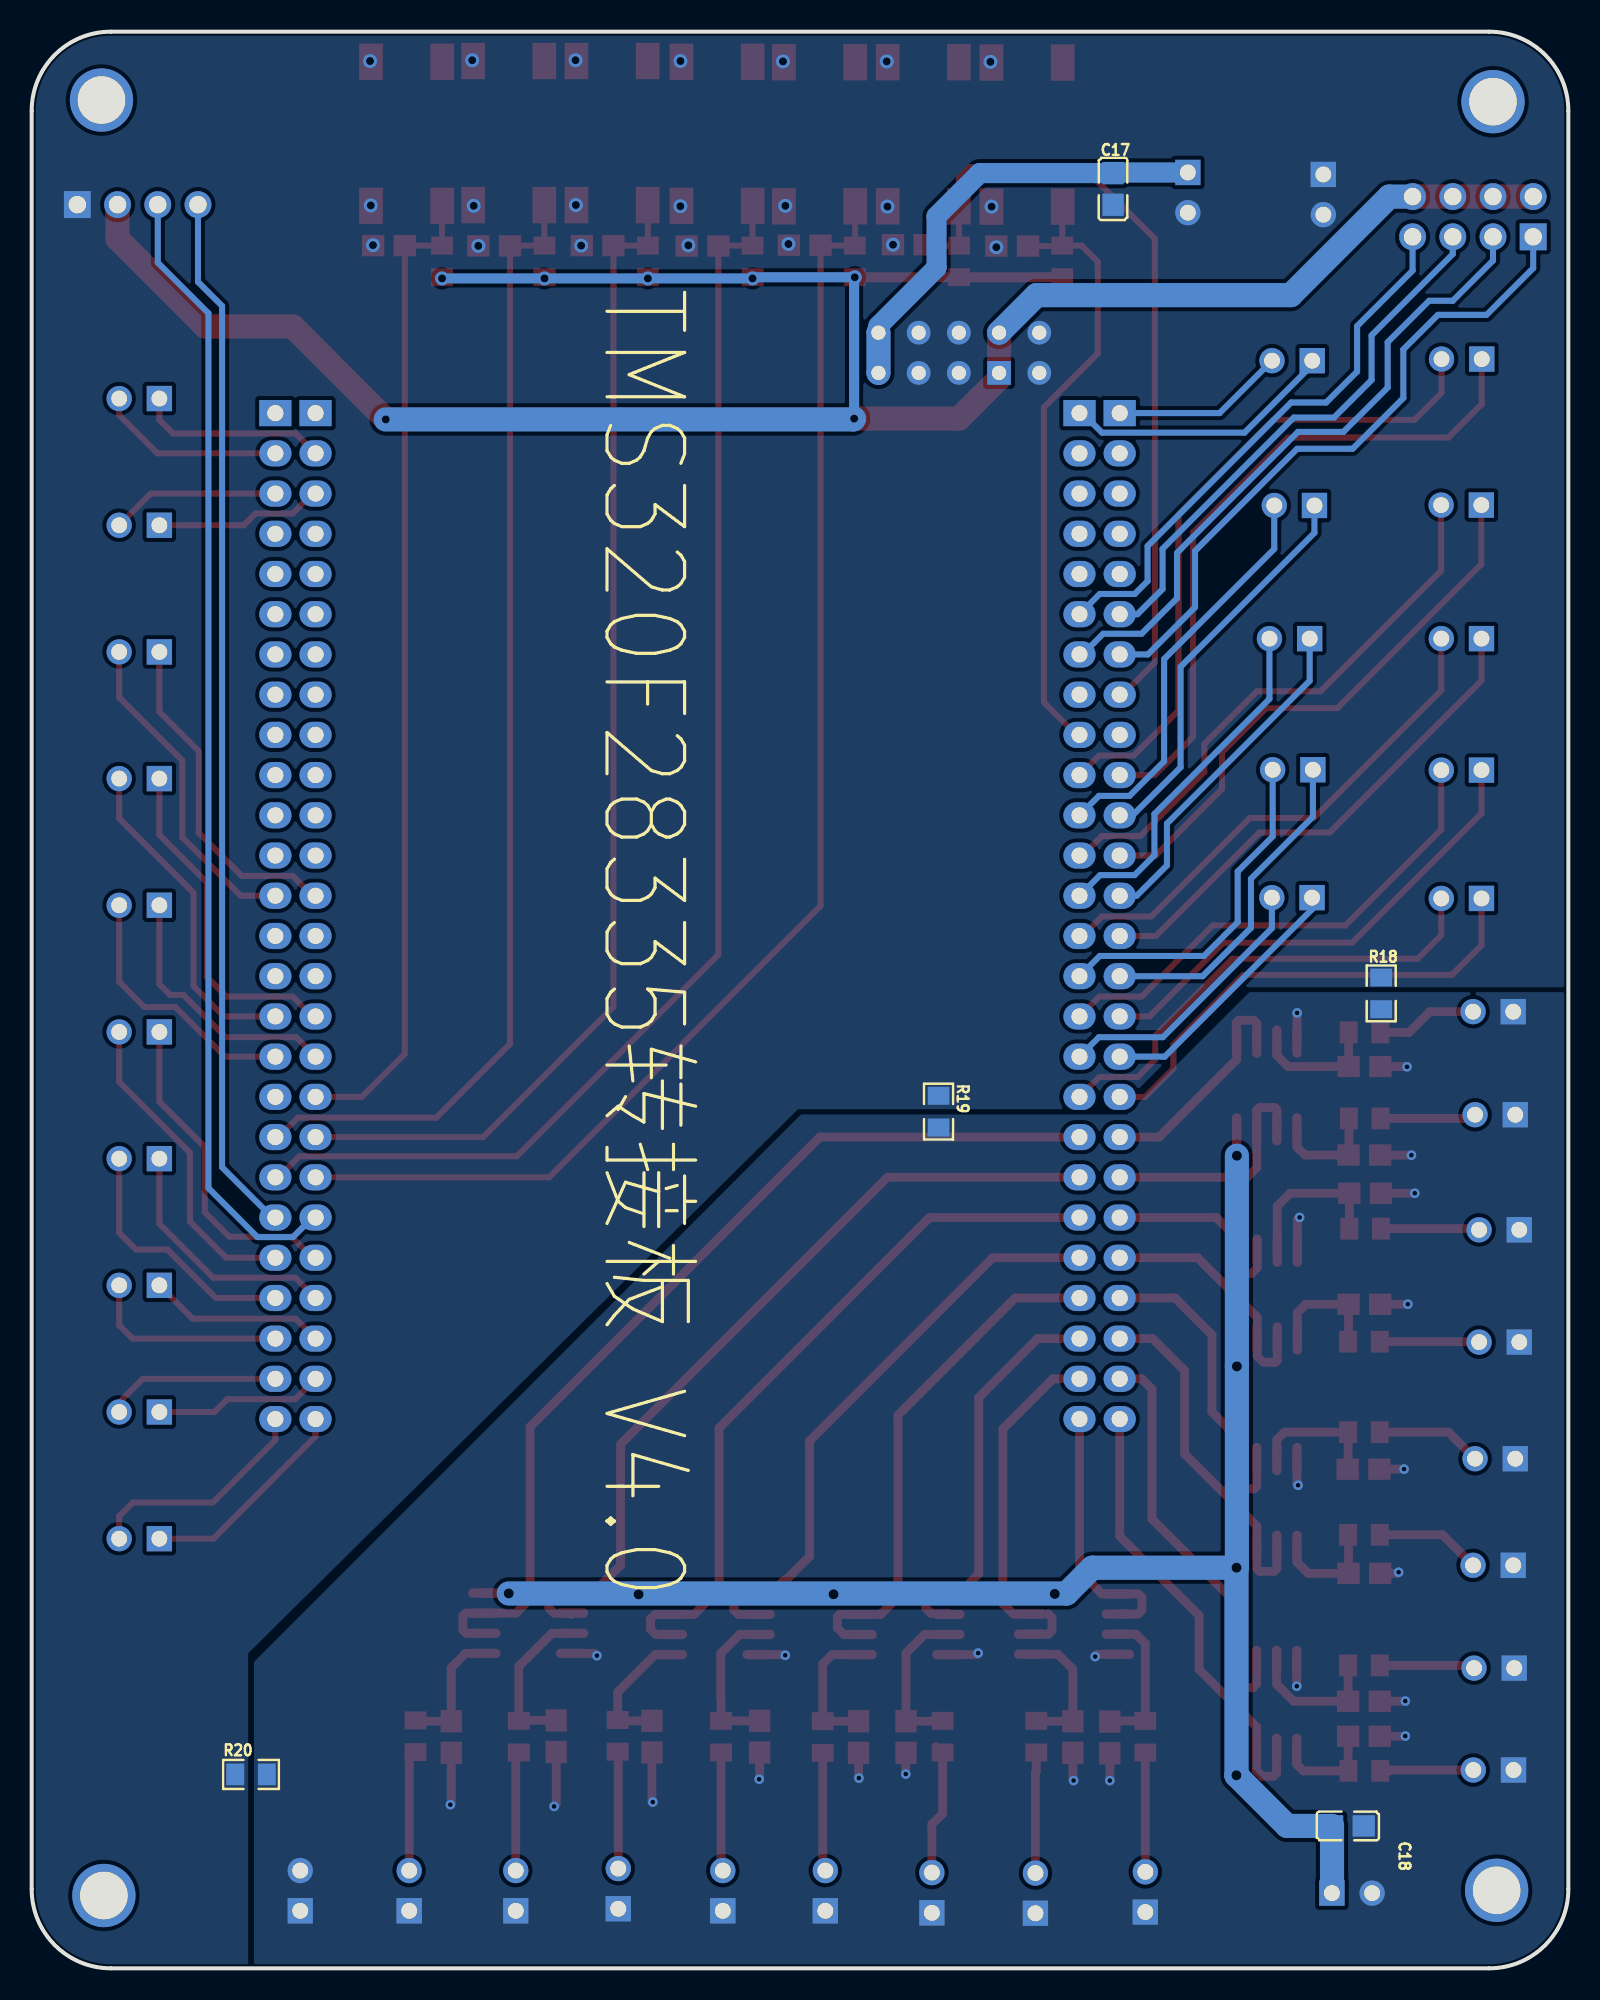
[diagram p4: board, bottom side, seen from below]

Outline 97.08 x 122.3 mm; copper layers: Top Layer, Bottom Layer. Coordinates in mm from the lower left corner of the outline.
Outline path: 0,117.3 0,5 arc(1.46,1.46) 5,0 92.08,0 arc(95.61,1.46) 97.08,5 97.08,117.3 arc(95.61,120.84) 92.08,122.3 5,122.3 arc(1.46,120.84) 0,117.3
Stack: Top Layer 0.035mm / Dielectric1 1.51mm FR4 er 4.5 / Bottom Layer 0.035mm

## Design rules (mm)
template: 自定义配置
spacing copperThickness1oz (default): track to track 0.102, other pairs 0.152 to 0.3
spacing copperThickness2oz: track to track 0.203, other pairs 0.152 to 0.3
track width copperThickness1oz (default): min 0.127, default 0.254, max 2.54
track width copperThickness2oz: min 0.203, default 0.254, max 2.54
differential pair differentialPair (default): width min 0.127, default 0.254, max 2.54; gap min 0.152, default 0.152
via viaSize (default): diameter min 0.5, default 0.61, max 10; hole min 0.3, default 0.305, max 6.3

## Placement (name value [footprint] x y rotation side)
C1  1nF  [C0805]  12.89 41.94 0 top
C2  1nF  [C0805]  51.09 14.63 270 top
C3  1nF  [C0805]  12.84 48.95 0 top
C4  1nF  [C0805]  57.9 14.63 270 top
C5  1nF  [C0805]  12.89 51.36 0 top
C6  1nF  [C0805]  63.94 14.66 270 top
C7  1nF  [C0805]  12.88 56.95 0 top
C8  1nF  [C0805]  70.57 14.61 270 top
C9  1nF  [C0805]  44.84 14.61 90 top
C10  1nF  [C0805]  12.94 31.52 180 top
C11  1nF  [C0805]  41.84 14.61 90 top
C12  1nF  [C0805]  12.89 24.94 180 top
C13  1nF  [C0805]  12.91 14.66 0 top
C14  1nF  [C0805]  12.91 16.87 180 top
C15  1nF  [C0805]  31.3 14.61 90 top
C16  1nF  [C0805]  28.97 14.58 270 top
C17  100nF  [C0805]  28.76 112.37 270 bottom
C18  100nF  [C0805]  13.93 8.99 180 bottom
C19  100nF  [C0805]  35.14 108.76 180 top
C20  100nF  [C0805]  41.66 108.85 180 top
C21  100nF  [C0805]  54.7 108.76 180 top
C22  100nF  [C0805]  48.24 108.81 180 top
C23  100nF  [C0805]  67.86 108.77 180 top
C24  100nF  [C0805]  61.32 108.79 180 top
C25  100nF  [C0805]  74.51 108.79 180 top
CN1  CON2-2.54*2P  [CONN-TH_2P-P2.54-V]  17.45 101.52 0 top
CN3  CON2-2.54*2P  [CONN-TH_2P-P2.54-V]  17.61 83.97 0 top
CN4  CON2-2.54*2P  [CONN-TH_2P-P2.54-V]  6.76 83.97 0 top
CN5  CON2-2.54*2P  [CONN-TH_2P-P2.54-V]  17.41 75.69 0 top
CN7  CON2-2.54*2P  [CONN-TH_2P-P2.54-V]  17.46 67.62 0 top
CN8  CON2-2.54*2P  [CONN-TH_2P-P2.54-V]  66.5 4.9 90 top
CN9  CON2-2.54*2P  [CONN-TH_2P-P2.54-V]  4.75 60.41 0 top
CN10  CON2-2.54*2P  [CONN-TH_2P-P2.54-V]  73.23 4.9 90 top
CN11  CON2-2.54*2P  [CONN-TH_2P-P2.54-V]  4.37 39.55 0 top
CN13  CON2-2.54*2P  [CONN-TH_2P-P2.54-V]  90.28 27.13 0 top
CN14  CON2-2.54*2P  [CONN-TH_2P-P2.54-V]  6.74 101.63 0 top
CN15  CON2-2.54*2P  [CONN-TH_2P-P2.54-V]  17.31 92.38 0 top
CN16  CON2-2.54*2P  [CONN-TH_2P-P2.54-V]  6.77 92.41 0 top
CN17  CON2-2.54*2P  [CONN-TH_2P-P2.54-V]  6.76 67.56 0 top
CN18  CON2-2.54*2P  [CONN-TH_2P-P2.54-V]  6.76 75.67 0 top
CN19  CON2-2.54*2P  [CONN-TH_2P-P2.54-V]  53.42 4.9 90 top
CN20  CON2-2.54*2P  [CONN-TH_2P-P2.54-V]  4.37 46.64 0 top
CN21  CON2-2.54*2P  [CONN-TH_2P-P2.54-V]  60.02 5.03 90 top
CN22  CON2-2.54*2P  [CONN-TH_2P-P2.54-V]  4.62 53.91 0 top
CN24  CON2-2.54*2P  [CONN-TH_2P-P2.54-V]  24.04 112.14 270 top
CN25  CON2-2.54*2P  [CONN-TH_2P-P2.54-V]  90.28 99.13 0 top
CN26  CON2-2.54*2P  [CONN-TH_2P-P2.54-V]  90.28 91.13 0 top
CN28  CON2-2.54*2P  [CONN-TH_2P-P2.54-V]  90.28 35.13 0 top
CN29  CON2-2.54*2P  [CONN-TH_2P-P2.54-V]  90.28 59.13 0 top
CN31  CON2-2.54*2P  [CONN-TH_2P-P2.54-V]  90.28 75.13 0 top
CN32  CON2-2.54*2P  [CONN-TH_2P-P2.54-V]  90.28 51.13 0 top
CN35  CON2-2.54*2P  [CONN-TH_2P-P2.54-V]  90.28 67.13 0 top
CN37  CON2-2.54*2P  [CONN-TH_2P-P2.54-V]  90.28 43.13 0 top
CN38  CON2-2.54*2P  [CONN-TH_2P-P2.54-V]  90.28 83.13 0 top
CN39  CON2-2.54*2P  [CONN-TH_2P-P2.54-V]  13.67 4.75 180 top
CN40  CON2-2.54*2P  [CONN-TH_2P-P2.54-V]  80.11 4.9 90 top
CN41  CON2-2.54*2P  [CONN-TH_2P-P2.54-V]  15.48 112.01 270 top
CN42  CON2-2.54*2P  [CONN-TH_2P-P2.54-V]  26.72 4.82 90 top
CN43  CON2-2.54*2P  [CONN-TH_2P-P2.54-V]  4.75 25.45 0 top
CN44  CON2-2.54*2P  [CONN-TH_2P-P2.54-V]  40.21 4.78 90 top
CN45  CON2-2.54*2P  [CONN-TH_2P-P2.54-V]  4.62 32.18 0 top
CN46  CON2-2.54*2P  [CONN-TH_2P-P2.54-V]  46.94 4.9 90 top
CN47  CON2-2.54*2P  [CONN-TH_2P-P2.54-V]  4.73 12.52 0 top
CN48  CON2-2.54*2P  [CONN-TH_2P-P2.54-V]  33.67 4.75 90 top
CN49  CON2-2.54*2P  [CONN-TH_2P-P2.54-V]  4.69 18.96 0 top
H1  2X4插座合高16MM公头  [HDR-TH_8P-P2.54-V-M-R2-C4-S2.54-2]  6.03 110.62 0 top
H2  HDR2.54-LI-2x4P  [HDR-TH_4P-P2.54-V-M]  90.38 111.38 180 top
NOREF  -  [Pad_e261]  92.67 117.98 0 top
NOREF#2  -  [Pad_e267]  4.76 117.88 0 top
NOREF#3  -  [Pad_e265]  92.52 4.6 0 top
NOREF#4  -  [Pad_e266]  4.53 4.93 0 top
R1  10K  [R0805]  12.91 39.57 0 top
R2  10K  [R0805]  53.53 14.63 90 top
R3  10K  [R0805]  12.84 46.71 0 top
R4  10K  [R0805]  60.06 14.68 90 top
R5  10K  [R0805]  12.86 53.67 0 top
R6  10K  [R0805]  66.3 14.63 90 top
R7  10K  [R0805]  12.88 59.11 0 top
R8  10K  [R0805]  72.83 14.66 90 top
R9  10K  [R0805]  47.1 14.61 90 top
R10  10K  [R0805]  12.91 33.86 0 top
R11  10K  [R0805]  39.53 14.63 90 top
R12  10K  [R0805]  12.91 27.38 0 top
R13  10K  [R0805]  12.89 12.47 0 top
R14  10K  [R0805]  12.91 19.13 0 top
R15  10K  [R0805]  33.61 14.63 90 top
R16  10K  [R0805]  26.72 14.62 90 top
R18  0  [R0805]  11.82 61.57 270 bottom
R19  0  [R0805]  39.79 54.1 270 bottom
R20  0  [R0805]  83.22 12.24 180 bottom
R21  10K  [R0805]  31.97 107.79 90 top
R22  10K  [R0805]  38.49 107.79 90 top
R23  10K  [R0805]  51.54 107.79 90 top
R24  10K  [R0805]  45.08 107.79 90 top
R25  10K  [R0805]  64.68 107.79 90 top
R26  10K  [R0805]  58.15 107.79 90 top
R27  10K  [R0805]  71.16 107.79 90 top
SW1  -  [SW-SMD_4P-L6.0-W6.0-P4.50-LS9.0-2]  34.2 115.8 90 top
SW2  -  [SW-SMD_4P-L6.0-W6.0-P4.50-LS9.0-2]  40.75 115.82 90 top
SW3  -  [SW-SMD_4P-L6.0-W6.0-P4.50-LS9.0-2]  53.78 115.85 90 top
SW4  -  [SW-SMD_4P-L6.0-W6.0-P4.50-LS9.0-2]  47.3 115.82 90 top
SW5  -  [SW-SMD_4P-L6.0-W6.0-P4.50-LS9.0-2]  66.94 115.9 90 top
SW6  -  [SW-SMD_4P-L6.0-W6.0-P4.50-LS9.0-2]  60.41 115.9 90 top
SW7  -  [SW-SMD_4P-L6.0-W6.0-P4.50-LS9.0-2]  73.39 115.85 90 top
TMS320F?  TMS320F28335_Board  [TMS320F28335]  59.59 64.81 0 top
U1  OPA2192IDR  [SOIC-8_L4.9-W3.9-P1.27-LS6.0-BL]  31.23 21.74 270 top
U2  OPA2192IDR  [SOIC-8_L4.9-W3.9-P1.27-LS6.0-BL]  41.94 21.72 270 top
U3  OPA2192IDR  [SOIC-8_L4.9-W3.9-P1.27-LS6.0-BL]  19.05 55.75 180 top
U4  OPA2192IDR  [SOIC-8_L4.9-W3.9-P1.27-LS6.0-BL]  19.06 16.57 180 top
U6  OPA2192IDR  [SOIC-8_L4.9-W3.9-P1.27-LS6.0-BL]  53.92 21.72 270 top
U7  OPA2192IDR  [SOIC-8_L4.9-W3.9-P1.27-LS6.0-BL]  19.02 42.55 180 top
U8  OPA2192IDR  [SOIC-8_L4.9-W3.9-P1.27-LS6.0-BL]  65.71 21.79 270 top
U9  OPA2192IDR  [SOIC-8_L4.9-W3.9-P1.27-LS6.0-BL]  19.05 29.39 180 top

## Footprints (pads in the part's own frame, mm; a bottom-side part is the same pattern mirrored in y, then rotated)
C0805
  rect 1.41x1.35 smd: 1(-1,0) 2(1,0)
CONN-TH_2P-P2.54-V
  rect 1.6x1.6 hole 1: 1(-1.27,0)
  round 1.6 hole 1: 2(1.27,0)
HDR-TH_4P-P2.54-V-M
  rect 1.7x1.7 hole 1.1: 1(-3.81,0)
  round 1.7 hole 1.1: 2(-1.27,0) 3(1.27,0) 4(3.81,0)
HDR-TH_8P-P2.54-V-M-R2-C4-S2.54-2
  rect 1.7x1.7 hole 1.1: 1(-3.81,-1.27)
  round 1.7 hole 1.1: 2(-3.81,1.27) 3(-1.27,-1.27) 4(-1.27,1.27) 5(1.27,-1.27) 6(1.27,1.27) 7(3.81,-1.27) 8(3.81,1.27)
Pad_e261
  round 4 hole 3: 115(0,0)
Pad_e265
  round 4 hole 3: 115(0,0)
Pad_e266
  round 4 hole 3: 115(0,0)
Pad_e267
  round 4 hole 3: 115(0,0)
R0805
  rect 1.133x1.377 smd: 1(-1,0) 2(1,0)
SOIC-8_L4.9-W3.9-P1.27-LS6.0-BL
  oval 0.588x2.045 smd: 1(-1.905,-2.772) 2(-0.635,-2.772) 3(0.635,-2.772) 4(1.905,-2.772) 5(1.905,2.772) 6(0.635,2.772) 7(-0.635,2.772) 8(-1.905,2.772)
SW-SMD_4P-L6.0-W6.0-P4.50-LS9.0-2
  rect 2.3x1.5 smd: 1(-4.55,2.25) 2(4.55,2.25) 3(-4.55,-2.25) 4(4.55,-2.25)
TMS320F28335
  rect 2.032x1.651 hole 1.016: 1(-28.702,33.401) 2(-31.242,33.401) 103(22.098,33.401) 104(19.558,33.401)
  oval 2.032x1.651 hole 1.016: 3(-28.702,30.861) 4(-31.242,30.861) 5(-28.702,28.321) 6(-31.242,28.321) 7(-28.702,25.781) 8(-31.242,25.781) 9(-28.702,23.241) 10(-31.242,23.241) 11(-28.702,20.701) 12(-31.242,20.701) 13(-28.702,18.161) 14(-31.242,18.161) 15(-28.702,15.621) 16(-31.242,15.621) 17(-28.702,13.081) 18(-31.242,13.081) 19(-28.702,10.541) 20(-31.242,10.541) 21(-28.702,8.001) 22(-31.242,8.001) 23(-28.702,5.461) 24(-31.242,5.461) 25(-28.702,2.921) 26(-31.242,2.921) 27(-28.702,0.381) 28(-31.242,0.381) 29(-28.702,-2.159) 30(-31.242,-2.159) 31(-28.702,-4.699) 32(-31.242,-4.699) 33(-28.702,-7.239) 34(-31.242,-7.239) 35(-28.702,-9.779) 36(-31.242,-9.779) 37(-28.702,-12.319) 38(-31.242,-12.319) 39(-28.702,-14.859) 40(-31.242,-14.859) 41(-28.702,-17.399) 42(-31.242,-17.399) 43(-28.702,-19.939) 44(-31.242,-19.939) 45(-28.702,-22.479) 46(-31.242,-22.479) 47(-28.702,-25.044) 48(-31.242,-25.044) 49(-28.702,-27.584) 50(-31.242,-27.584) 51(-28.702,-30.125) 52(-31.242,-30.125) 53(22.098,-30.125) 54(19.558,-30.125) 55(22.098,-27.584) 56(19.558,-27.584) 57(22.098,-25.044) 58(19.558,-25.044) 59(22.098,-22.479) 60(19.558,-22.479) 61(22.098,-19.939) 62(19.558,-19.939) 63(22.098,-17.399) 64(19.558,-17.399) 65(22.098,-14.859) 66(19.558,-14.859) 67(22.098,-12.319) 68(19.558,-12.319) 69(22.098,-9.779) 70(19.558,-9.779) 71(22.098,-7.239) 72(19.558,-7.239) 73(22.098,-4.699) 74(19.558,-4.699) 75(22.098,-2.159) 76(19.558,-2.159) 77(22.098,0.381) 78(19.558,0.381) 79(22.098,2.921) 80(19.558,2.921) 81(22.098,5.461) 82(19.558,5.461) 83(22.098,8.001) 84(19.558,8.001) 85(22.098,10.541) 86(19.558,10.541) 87(22.098,13.081) 88(19.558,13.081) 89(22.098,15.621) 90(19.558,15.621) 91(22.098,18.161) 92(19.558,18.161) 93(22.098,20.701) 94(19.558,20.701) 95(22.098,23.241) 96(19.558,23.241) 97(22.098,25.781) 98(19.558,25.781) 99(22.098,28.321) 100(19.558,28.321) 101(22.098,30.861) 102(19.558,30.861)
  round 1.5 hole 0.9: 105(-16.002,35.941) 106(-16.002,38.481) 107(-18.542,35.941) 108(-18.542,38.481) 109(-21.082,35.941) 110(-21.082,38.481) 112(-23.622,38.481) 113(-26.162,35.941) 114(-26.162,38.481)
  rect 1.5x1.5 hole 0.9: 111(-23.622,35.941)

## Nets
+5V: C18.1 CN39.1 U1.8 U2.8 U3.8 U4.8 U6.8 U7.8 U8.8 U9.8
+5V_D: C17.1 CN24.1 TMS320F?.105 TMS320F?.106
AGND: C17.2 C19.1 C20.1 C21.1 C22.1 C23.1 C24.1 C25.1 CN24.2 CN41.1 CN41.2 H2.1 R18.1 R19.1 R20.1 SW1.3 SW1.4 SW2.3 SW2.4 SW3.3 SW3.4 SW4.3 SW4.4 SW5.3 SW5.4 SW6.3 SW6.4 SW7.3 SW7.4 TMS320F?.107 TMS320F?.108 TMS320F?.109 TMS320F?.110 TMS320F?.113 TMS320F?.114
GND: C1.1 C2.2 C3.1 C4.2 C5.1 C6.2 C7.1 C8.2 C9.1 C10.2 C11.1 C12.2 C13.1 C14.2 C15.1 C16.2 C18.2 CN8.1 CN9.1 CN10.1 CN11.1 CN19.1 CN20.1 CN21.1 CN22.1 CN39.2 CN40.1 CN40.2 CN42.1 CN43.1 CN44.1 CN45.1 CN46.1 CN47.1 CN48.1 CN49.1 R18.2 R19.2 R20.2 U1.4 U2.4 U3.4 U4.4 U6.4 U7.4 U8.4 U9.4
VCC: H1.2 H1.4 H1.6 H1.8 H2.2 R21.1 R22.1 R23.1 R24.1 R25.1 R26.1 R27.1 TMS320F?.111 TMS320F?.112
A0_IN: C1.2 R1.2 U7.5
A0_OUT: TMS320F?.44 U7.6 U7.7
A1_IN: C2.1 R2.2 U6.3
A1_OUT: TMS320F?.43 U6.1 U6.2
A2_IN: C3.2 R3.2 U7.3
A2_OUT: TMS320F?.42 U7.1 U7.2
A3_IN: C4.1 R4.2 U6.5
A3_OUT: TMS320F?.41 U6.6 U6.7
A4_IN: C5.2 R5.2 U3.5
A4_OUT: TMS320F?.40 U3.6 U3.7
A5_IN: C6.1 R6.2 U8.3
A5_OUT: TMS320F?.39 U8.1 U8.2
A6_IN: C7.2 R7.2 U3.3
A6_OUT: TMS320F?.38 U3.1 U3.2
A7_IN: C8.1 R8.2 U8.5
A7_OUT: TMS320F?.37 U8.6 U8.7
ADCA0: CN11.2 R1.1
ADCA1: CN19.2 R2.1
ADCA2: CN20.2 R3.1
ADCA3: CN21.2 R4.1
ADCA4: CN22.2 R5.1
ADCA5: CN8.2 R6.1
ADCA6: CN9.2 R7.1
ADCA7: CN10.2 R8.1
ADCB0: CN46.2 R9.1
ADCB1: CN45.2 R10.1
ADCB2: CN44.2 R11.1
ADCB3: CN43.2 R12.1
ADCB4: CN48.2 R15.1
ADCB5: CN49.2 R14.1
ADCB6: CN42.2 R16.1
ADCB7: CN47.2 R13.1
B0_IN: C9.2 R9.2 U2.5
B0_OUT: TMS320F?.45 U2.6 U2.7
B1_IN: C10.1 R10.2 U9.3
B1_OUT: TMS320F?.46 U9.1 U9.2
B2_IN: C11.2 R11.2 U2.3
B2_OUT: TMS320F?.47 U2.1 U2.2
B3_IN: C12.1 R12.2 U9.5
B3_OUT: TMS320F?.48 U9.6 U9.7
B4_IN: C15.2 R15.2 U1.5
B4_OUT: TMS320F?.49 U1.6 U1.7
B5_IN: C14.1 R14.2 U4.3
B5_OUT: TMS320F?.50 U4.1 U4.2
B6_IN: C16.1 R16.2 U1.3
B6_OUT: TMS320F?.51 U1.1 U1.2
B7_IN: C13.2 R13.2 U4.5
B7_OUT: TMS320F?.52 U4.6 U4.7
GPIO12: CN18.2 TMS320F?.31
GPIO13: CN18.1 TMS320F?.32
GPIO14: CN7.2 TMS320F?.33
GPIO15: CN7.1 TMS320F?.34
GPIO16: CN17.2 TMS320F?.35
GPIO17: CN17.1 TMS320F?.36
GPIO18: CN13.2 TMS320F?.53
GPIO19: CN13.1 TMS320F?.54
GPIO20: CN28.2 TMS320F?.55
GPIO21: CN28.1 TMS320F?.56
GPIO22: CN37.2 TMS320F?.57
GPIO23: CN37.1 TMS320F?.58
GPIO24: CN32.2 TMS320F?.59
GPIO25: CN32.1 TMS320F?.60
GPIO26: CN29.2 TMS320F?.61
GPIO27: CN29.1 TMS320F?.62
GPIO30: C19.2 R21.2 SW1.1 TMS320F?.17
GPIO31: C20.2 R22.2 SW2.1 TMS320F?.16
GPIO34: CN26.2 TMS320F?.99
GPIO35: CN25.2 TMS320F?.101
GPIO36: CN26.1 TMS320F?.100
GPIO37: CN25.1 TMS320F?.102
GPIO42: CN1.1 TMS320F?.1
GPIO43: CN1.2 TMS320F?.2
GPIO48: C21.2 R23.2 SW3.1 TMS320F?.65
GPIO49: C22.2 R24.2 SW4.1 TMS320F?.66
GPIO50: C23.2 R25.2 SW5.1 TMS320F?.67
GPIO51: C24.2 R26.2 SW6.1 TMS320F?.68
GPIO53: C25.2 R27.2 SW7.1 TMS320F?.70
GPIO54: CN35.2 TMS320F?.71
GPIO55: CN35.1 TMS320F?.72
GPIO56: CN31.2 TMS320F?.73
GPIO57: CN31.1 TMS320F?.74
GPIO62: CN38.2 TMS320F?.79
GPIO63: CN38.1 TMS320F?.80
GPIO84: H1.7 TMS320F?.11
GPIO85: H1.5 TMS320F?.12
GPIO86: H1.3 TMS320F?.13
GPIO87: H1.1 TMS320F?.14
PWM1A: CN14.2 TMS320F?.19
PWM1B: CN14.1 TMS320F?.20
PWM2A: CN15.2 TMS320F?.21
PWM2B: CN15.1 TMS320F?.22
PWM3A: CN16.2 TMS320F?.23
PWM3B: CN16.1 TMS320F?.24
PWM4A: CN3.2 TMS320F?.25
PWM4B: CN3.1 TMS320F?.26
PWM5A: CN4.2 TMS320F?.27
PWM5B: CN4.1 TMS320F?.28
PWM6A: CN5.2 TMS320F?.29
PWM6B: CN5.1 TMS320F?.30
SCLA: H2.3 TMS320F?.64
SDAA: H2.4 TMS320F?.63

Pads without a net: NOREF 115; NOREF#2 115; NOREF#3 115; NOREF#4 115; SW1 2; SW2 2; SW3 2; SW4 2; SW5 2; SW6 2; SW7 2; TMS320F? 3 4 5 6 7 8 9 10 15 18 69 75 76 77 78 81 82 83 84 85 86 87 88 89 90 91 92 93 94 95 96 97 98 103 104

## Via types
v1: diameter 0.889, hole 0.508, Top Layer to Bottom Layer, 28 vias
v2: diameter 0.61, hole 0.305, Top Layer to Bottom Layer, 24 vias
v3: diameter 1.143, hole 0.635, Top Layer to Bottom Layer, 8 vias

## Routing (per net, layer and track width the routed paths; a pad name or vN(x,y) marks a point on that pad's centre or on a via; arc(x,y) is an arc through that point)
+5V: length 110.4
  Top Layer w0.559: U1.8 v3(32.45,23.64)
  Top Layer w0.584: U3.8 20.95,51.33 v3(20.94,51.32) ; U2.8 v3(46.42,23.62) 46.44,23.64 ; v3(58.74,23.62) 58.73,23.62 U6.8 ; U9.8 20.95,25.31 v3(20.96,25.3) ; U8.8 67.06,23.7 ; U7.8 20.94,39.76 20.94,38.11 ; U4.8 v3(20.97,12.19)
  Bottom Layer w1.524: v3(20.94,51.32) v3(20.94,38.01) 20.94,25.32 v3(20.96,25.3) ; CN39.1 14.93,4.76 C18.1 17.77,8.99 v3(20.97,12.19) 20.96,12.2 v3(20.96,25.3) ; v3(20.96,25.3) 30.07,25.3 31.7,23.67 v3(66.94,23.67)
+5V_D: length 28.4
  Bottom Layer w1.27: TMS320F?.106 43.58,103.72 39.91,107.39 39.91,110.64 37.19,113.37 C17.1 28.72,113.41 24.04,113.41
  Bottom Layer w1.524: TMS320F?.106 TMS320F?.105
AGND: length 0.9
  Top Layer w0.508: v1(36.44,111.25) 36.44,111.25 SW1.3 ; SW4.4 49.57,120.37 v1(49.62,120.42) ; SW1.4 36.46,120.35 v1(36.51,120.4) ; SW4.3 49.5,111.27 v1(49.47,111.3) ; v1(56.1,111.28) 56.07,111.3 56.03,111.3 ; v1(75.7,120.45) 75.65,120.4 SW7.4 ; v1(62.72,120.5) 62.67,120.45 SW6.4 ; SW3.4 56.04,120.4 v1(56.09,120.45) ; v1(69.25,120.5) 69.2,120.45 SW5.4 ; v1(43.02,111.25) 43,111.27 SW2.3 ; SW6.3 62.7,111.35 v1(62.7,111.35) ; v1(43.06,120.42) 43.01,120.37 SW2.4 ; v1(75.66,111.33) 75.64,111.31 75.64,111.3 ; v1(69.15,111.3) 69.19,111.34 SW5.3
  vias: v1(36.14,108.69) v1(42.66,108.85) v1(49.27,108.89) v1(55.6,108.81) v1(62.37,108.79) v1(68.86,108.77) v1(75.52,108.82)
GND: length 45.5
  Top Layer w0.559: v2(44.82,12.01) 44.84,12.04 C9.1 ; U8.4 61.51,19.89 v2(61.37,19.75) ; C11.1 41.86,13.59 v2(41.86,12.27) ; v2(37.29,19.91) 37.38,19.81 39.16,19.81 ; C14.2 10.31,16.87 v2(10.3,16.88) ; v2(31.25,11.86) 31.3,11.91 C15.1 ; C4.2 57.9,10.56 v2(57.84,10.5) ; C10.2 10.38,31.52 v2(10.38,31.53) ; U7.4 17.12,47.28 v2(16.98,47.42) ; v2(10.3,14.67) 10.31,14.66 C13.1 ; v2(51.12,11.94) 51.09,11.98 C2.2 ; v2(29.89,19.69) 29.75,19.83 U1.4 ; v2(10.72,25.01) 10.79,24.94 C12.2 ; v2(17.08,30.51) 17.14,30.58 U9.4 ; U6.4 49.52,19.81 v2(49.47,19.77) ; C3.1 v2(9.7,48.95) ; v2(70.63,10.33) 70.57,10.39 C8.2 ; C5.1 11.88,51.35 v2(9.92,51.35) ; v2(10.19,56.93) 10.21,56.95 C7.1 ; C6.2 63.94,10.36 v2(64.07,10.23) ; v2(17.16,17.82) U4.4 ; C1.1 10.15,41.94 v2(10.14,41.94) ; v2(17.14,60.34) 17.14,60.33 U3.4 ; C16.2 28.97,11.86 v2(28.97,11.86)
VCC: length 152
  Top Layer w0.635: v1(45.08,106.79) R22.1 R21.1
  Top Layer w1.524: v1(74.71,97.82) 80.58,103.68 86.11,103.68 91.65,109.22 H2.2 ; 9.84,111.89 2.22,111.89 ; v1(45.12,97.87) 38.49,97.87 35.96,100.39 TMS320F?.111 TMS320F?.112
  Bottom Layer w0.635: v1(71.16,106.72) v1(64.68,106.72) v1(58.15,106.72) v1(51.54,106.72) 51.47,106.79 v1(45.08,106.79) 45.12,106.75 v1(45.12,97.87)
  Bottom Layer w1.524: v1(74.71,97.82) 45.17,97.82 v1(45.12,97.87) ; 9.84,111.89 11.31,111.89 17.54,105.66 33.59,105.66 TMS320F?.112
A0_IN: length 7.5
  Top Layer w0.559: U7.5 17.12,41.4 16.59,41.94 C1.2 13.89,39.6 R1.2
A0_OUT: length 15.5
  Top Layer w0.559: U7.6 18.39,38.39 18.51,38.28 19.27,38.28 19.66,38.66 U7.7 19.66,41.11 23.42,44.87 TMS320F?.44
A1_IN: length 9.6
  Top Layer w0.559: C2.1 R2.2 53.53,17 53.54,17.02 53.54,19.89 52.35,21.08 U6.3
A1_OUT: length 37.3
  Top Layer w0.559: U6.2 52.44,22.35 52.71,22.62 52.71,23.2 52.28,23.62 U6.1 50.42,23.62 49.57,24.48 49.47,24.48 47.94,26.01 47.94,33.3 36.37,44.87 TMS320F?.43
A2_IN: length 9.9
  Top Layer w0.559: R3.2 C3.2 17.58,48.95 18.39,48.13 U7.3
A2_OUT: length 12.5
  Top Layer w0.559: U7.2 19.66,44.24 20.03,43.86 20.54,43.86 20.93,44.25 U7.1 20.93,46.11 22.23,47.41 TMS320F?.42
A3_IN: length 8.3
  Top Layer w0.559: C4.1 60,15.63 R4.2 60.06,17.44 57.68,19.81 U6.5
A3_OUT: length 45.6
  Top Layer w0.559: U6.6 57.65,21.08 57.98,21.42 57.98,22.05 57.68,22.35 U6.7 55.23,22.35 53.65,23.93 53.65,34.11 40.35,47.41 TMS320F?.41
A4_IN: length 6.9
  Top Layer w0.559: R5.2 13.86,51.38 C5.2 16.64,51.36 17.14,51.87 U3.5
A4_OUT: length 15.2
  Top Layer w0.559: 18.42,52.98 18.42,54.22 18.55,54.36 19.52,54.36 19.69,54.19 U3.7 19.69,50.56 20.29,49.95 TMS320F?.40
A5_IN: length 10
  Top Layer w0.559: C6.1 66.28,15.66 R6.2 66.3,19.07 64.21,21.16 U8.3
A5_OUT: length 51.4
  Top Layer w0.559: U8.2 63,22.36 63.07,22.43 64.07,22.43 64.4,22.76 64.4,23.55 64.25,23.7 U8.1 61.63,23.7 59.88,25.45 59.88,33.1 43.02,49.95 TMS320F?.39
A6_IN: length 7.9
  Top Layer w0.559: R7.2 C7.2 17.7,56.95 18.42,57.66 18.42,58.53
A6_OUT: length 14.3
  Top Layer w0.559: U3.2 19.69,59.68 19.87,59.87 20.81,59.87 20.98,59.7 20.98,58.55 U3.1 20.95,57.39 25.85,52.49 TMS320F?.38
A7_IN: length 8.1
  Top Layer w0.559: R8.2 72.78,15.61 C8.1 70.57,18.99 69.67,19.89 U8.5
A7_OUT: length 60.2
  Top Layer w0.559: U8.6 69.63,21.16 69.83,21.36 69.83,22.25 69.66,22.43 U8.7 66.48,22.43 65.59,23.32 65.59,34.19 47.29,52.49 TMS320F?.37
ADCA0: length 6.3
  Top Layer w0.559: R1.1 5.66,39.57 CN11.2
ADCA1: length 7.5
  Top Layer w0.559: R2.1 53.53,6.28 CN19.2
ADCA2: length 6.2
  Top Layer w0.559: R3.1 5.71,46.71 CN20.2
ADCA3: length 7.4
  Top Layer w0.559: CN21.2 60.02,13.65 R4.1
ADCA4: length 6.1
  Top Layer w0.559: R5.1 6.13,53.67 CN22.2
ADCA5: length 7.5
  Top Layer w0.559: R6.1 66.5,13.44 CN8.2
ADCA6: length 6.4
  Top Layer w0.559: R7.1 10.06,59.11 8.75,60.41 CN9.2
ADCA7: length 7.6
  Top Layer w0.559: R8.1 73.23,13.26 CN10.2
ADCB0: length 7.6
  Top Layer w0.559: 47.19,13.55 47.14,13.61 R9.1 47.1,6.33 CN46.2
ADCB1: length 6.7
  Top Layer w0.559: CN45.2 7.57,33.86 R10.1
ADCB2: length 8.4
  Top Layer w0.559: 39.94,13.99 39.57,13.63 R11.1 39.53,9.77 40.21,9.09 CN44.2
ADCB3: length 6.7
  Top Layer w0.559: R12.1 7.95,27.38 CN43.2
ADCB4: length 7.6
  Top Layer w0.559: R15.1 33.61,12.44 33.67,12.38 CN48.2
ADCB5: length 6
  Top Layer w0.559: CN49.2 6.12,19.13 R14.1
ADCB6: length 7.5
  Top Layer w0.559: CN42.2 R16.1
ADCB7: length 5.9
  Top Layer w0.559: R13.1 11.29,12.47 11.24,12.52 CN47.2
B0_IN: length 8.5
  Top Layer w0.559: U2.5 46.51,19.81 47.1,19.22 R9.2 C9.2
B0_OUT: length 32.7
  Top Layer w0.559: U2.6 45.77,21.08 46.18,21.49 46.18,22.2 46.03,22.35 U2.7 43.44,22.35 42.35,23.44 42.35,34.93 34.94,42.33 TMS320F?.45
B1_IN: length 8.3
  Top Layer w0.559: 18.42,32.16 18.42,33.38 17.93,33.86 R10.2 13.91,31.55 C10.1
B1_OUT: length 20.1
  Top Layer w0.559: TMS320F?.46 24.84,42.33 22.51,40.01 22.51,35.13 20.95,33.57 U9.1 20.95,30.47 20.76,30.28 19.86,30.28 19.69,30.46 U9.2
B2_IN: length 9.8
  Top Layer w0.559: 39.16,21.08 40.67,21.08 41.84,19.9 C11.2 39.56,15.61 R11.2
B2_OUT: length 25.2
  Top Layer w0.559: 39.16,22.35 39.23,22.42 40.27,22.42 40.59,22.74 40.59,23.32 40.28,23.62 38.54,23.62 37.25,24.92 37.25,36.04 33.52,39.77 30.88,39.77
B3_IN: length 7
  Top Layer w0.559: U9.5 17.14,25.65 16.43,24.94 C12.1 13.89,27.36 R12.2
B3_OUT: length 22.1
  Top Layer w0.559: 28.34,39.77 26.26,39.77 24.24,37.74 24.24,32.49 19.69,27.93 U9.7 19.69,25.24 19.52,25.07 18.59,25.07 18.42,25.25 18.42,26.62
B4_IN: length 8.7
  Top Layer w0.559: U1.5 32.25,19.83 31.3,18.89 C15.2 33.59,15.61 R15.2
B4_OUT: length 22.9
  Top Layer w0.559: U1.6 32.86,21.1 32.62,21.34 32.62,22.15 32.85,22.37 U1.7 35.06,22.37 35.72,23.04 35.72,34.06 32.56,37.23 TMS320F?.49
B5_IN: length 8.6
  Top Layer w0.559: U4.3 18.43,17.94 17.35,16.87 C14.1 R14.2
B5_OUT: length 26
  Top Layer w0.559: U4.2 19.7,17.95 19.94,17.72 20.74,17.72 20.97,17.94 U4.1 20.97,23.04 26.3,28.37 26.3,36.58 26.95,37.23 TMS320F?.50
B6_IN: length 9.1
  Top Layer w0.559: U1.3 27.32,21.1 26.72,20.51 R16.2 28.92,15.62 C16.1
B6_OUT: length 16.7
  Top Layer w0.559: U1.2 27.19,22.37 26.94,22.63 26.94,23.42 27.16,23.64 U1.1 29.47,23.64 30.88,25.06 30.88,34.69
B7_IN: length 6.6
  Top Layer w0.559: U4.5 17.16,12.88 16.75,12.47 R13.2 13.91,12.5 C13.2
B7_OUT: length 28.7
  Top Layer w0.559: 28.34,34.69 28.34,27.29 23.33,22.28 23.33,18.87 19.7,15.24 U4.7 19.7,12.48 19.34,12.13 18.64,12.13 18.43,12.34 U4.6
GPIO12: length 31.5
  Top Layer w0.381: TMS320F?.31 29.63,61.37 26.96,61.37 22.46,65.86 14.08,65.86 8.03,71.92 CN18.2
GPIO13: length 30.9
  Top Layer w0.381: TMS320F?.32 26.46,60.11 21.8,64.77 13.65,64.77 5.49,72.93 CN18.1
GPIO14: length 17.4
  Bottom Layer w0.381: TMS320F?.33 29.66,58.8 25.61,58.8 18.73,65.68 CN7.2
GPIO15: length 16.7
  Bottom Layer w0.381: CN7.1 16.19,66.88 25.49,57.57 TMS320F?.34
GPIO16: length 30.3
  Top Layer w0.381: TMS320F?.35 29.63,56.29 27.21,56.29 26.1,57.4 26.1,58.9 21.24,63.75 9.51,63.75 8.03,65.24 CN17.2
GPIO17: length 30.7
  Top Layer w0.381: CN17.1 5.49,64.6 7.35,62.74 20.53,62.74 24.95,58.32 24.95,56.82 26.74,55.03 TMS320F?.36
GPIO18: length 14.6
  Top Layer w0.381: 81.68,34.69 81.68,33.36 85.63,29.41 90.69,29.41 91.55,28.55 CN13.2
GPIO19: length 13.6
  Top Layer w0.381: 79.14,34.69 79.14,33.59 85.6,27.13 CN13.1
GPIO20: length 11.1
  Top Layer w0.381: CN28.2 91.55,35.74 90.06,37.23 TMS320F?.55
GPIO21: length 10.7
  Top Layer w0.381: CN28.1 85.53,35.13 84.72,35.94 80.43,35.94 TMS320F?.56
GPIO22: length 12.7
  Top Layer w0.381: CN37.2 91.55,40.62 90.7,39.77 81.68,39.77
GPIO23: length 11.3
  Top Layer w0.381: CN37.1 86.9,41.02 80.4,41.02 79.14,39.77
GPIO24: length 16.3
  Top Layer w0.381: CN32.2 91.55,46.46 90.48,45.39 88.5,45.39 85.45,42.33 TMS320F?.59
GPIO25: length 15.9
  Top Layer w0.381: CN32.1 89.01,47.02 85.61,43.61 80.42,43.61 TMS320F?.60
GPIO26: length 20.2
  Top Layer w0.381: CN29.2 91.55,55.98 87.08,51.51 87.08,47.17 84.79,44.87 TMS320F?.61
GPIO27: length 20.8
  Top Layer w0.381: CN29.1 89.01,54.74 86.14,51.87 86.14,47.75 84.59,46.2 80.66,46.2 79.33,44.87 TMS320F?.62
GPIO30: length 39.9
  Top Layer w0.381: R21.2 31.97,111.23 SW1.1 ; R21.2 31.97,108.59 32.14,108.76 C19.2 ; R21.2 30.75,108.79 29.73,107.77 29.73,101.98 33.13,98.58 33.13,79.95 31.07,77.89 TMS320F?.17
GPIO31: length 50.8
  Top Layer w0.381: C20.2 40.61,108.79 R22.2 38.49,111.26 SW2.1 38.5,113.05 37.8,113.74 30.64,113.74 26.12,109.22 26.12,82.47 28.15,80.43 TMS320F?.16
GPIO34: length 10.7
  Top Layer w0.381: CN26.2 89.55,93.13 TMS320F?.99
GPIO35: length 11.9
  Top Layer w0.381: CN25.2 91.55,98.1 89.13,95.67 TMS320F?.101
GPIO36: length 10.7
  Top Layer w0.381: TMS320F?.100 79.33,93.13 80.59,91.87 82.94,91.87 83.68,91.13 CN26.1
GPIO37: length 12.1
  Top Layer w0.381: TMS320F?.102 80.4,96.93 88.15,96.93 89.01,97.79 CN25.1
GPIO42: length 17.3
  Bottom Layer w0.381: CN1.1 16.18,101.25 20.46,96.98 29.46,96.98 30.69,98.21 TMS320F?.1
GPIO43: length 11
  Bottom Layer w0.381: CN1.2 22.03,98.21 TMS320F?.2
GPIO48: length 83.2
  Top Layer w0.381: 51.53,111.3 51.54,111.29 R23.2 53.67,108.79 C21.2 53.7,64.02 66.43,51.28 80.16,51.28 81.49,49.95 TMS320F?.65
GPIO49: length 85.4
  Top Layer w0.381: SW4.1 45.05,108.82 R24.2 47.22,108.79 C22.2 47.24,67.09 64.38,49.95 TMS320F?.66
GPIO50: length 72.4
  Top Layer w0.381: TMS320F?.67 81.49,52.49 80.26,53.72 71.51,53.72 66.86,58.37 C23.2 66.84,108.79 R25.2 64.69,108.8 SW5.1
GPIO51: length 75
  Top Layer w0.381: SW6.1 58.15,111.34 R26.2 60.32,108.79 C24.2 60.32,60.72 68.55,52.49 TMS320F?.68
GPIO53: length 62.7
  Top Layer w0.381: 71.14,111.3 71.16,111.29 R27.2 73.5,108.79 C25.2 73.51,57.74 76.22,55.03 TMS320F?.70
GPIO54: length 16.7
  Top Layer w0.381: TMS320F?.71 84.86,57.57 88,60.71 89.95,60.71 91.55,62.31 CN35.2
GPIO55: length 16.7
  Top Layer w0.381: CN35.1 89.01,62.15 88.33,61.47 87.49,61.47 84.82,58.8 80.37,58.8 TMS320F?.72
GPIO56: length 21
  Top Layer w0.381: CN31.2 91.55,72.62 86.85,67.92 86.85,62.03 84.94,60.11 TMS320F?.73
GPIO57: length 21.7
  Top Layer w0.381: CN31.1 89.01,71.58 86.01,68.58 86.01,62.61 84.77,61.37 80.59,61.37 79.33,60.11 TMS320F?.74
GPIO62: length 20.8
  Top Layer w0.381: CN38.2 91.55,80.26 87.56,76.28 87.56,71.43 83.87,67.73 TMS320F?.79
GPIO63: length 21.5
  Top Layer w0.381: TMS320F?.80 79.33,67.73 80.59,68.99 83.8,68.99 86.52,71.7 86.52,76.86 89.01,79.35 CN38.1
GPIO84: length 35.1
  Bottom Layer w0.381: H1.7 9.84,107.21 13.34,103.71 13.34,100.84 15.3,98.88 17.51,98.88 26.58,89.82 26.58,87.61 27.39,86.79 29.6,86.79 TMS320F?.11
GPIO85: length 34.7
  Bottom Layer w0.381: TMS320F?.12 27.22,85.51 25.64,87.1 25.64,89.64 17.34,97.93 14.8,97.93 12.43,100.31 12.43,103.12 7.3,108.26 H1.5
GPIO86: length 41.3
  Bottom Layer w0.381: TMS320F?.13 30.69,82.97 29.39,84.28 26.96,84.28 24.72,86.51 24.72,89.38 17.08,97.03 14.21,97.03 11.41,99.82 11.41,102.69 8.8,105.31 7.3,105.31 4.76,107.85 H1.3
GPIO87: length 42.1
  Bottom Layer w0.381: H1.1 2.22,107.37 5.17,104.42 8.24,104.42 10.42,102.24 10.42,99.16 13.62,95.96 17.13,95.96 23.58,89.51 23.58,85.95 26.56,82.97 TMS320F?.14
PWM1A: length 42.3
  Top Layer w0.381: CN14.2 8.01,99.49 9.71,97.79 18.63,97.79 24.62,91.8 24.62,79.43 27.47,76.58 29.66,76.58 TMS320F?.19
PWM1B: length 43
  Top Layer w0.381: TMS320F?.20 26.13,75.35 23.71,77.78 23.71,90.68 17.71,96.67 7.58,96.67 5.47,98.78 CN14.1
PWM2A: length 25.8
  Bottom Layer w0.381: CN15.2 18.58,89.64 25.54,82.68 25.54,76.23 27.72,74.04 29.66,74.04 TMS320F?.21
PWM2B: length 25.1
  Bottom Layer w0.381: CN15.1 16.04,90.65 24.5,82.19 24.5,75.84 27.53,72.81 TMS320F?.22
PWM3A: length 35.5
  Top Layer w0.381: TMS320F?.23 30.69,70.27 29.47,71.5 27.03,71.5 23,75.54 23,77.32 19.67,80.65 15.66,80.65 8.04,88.27 CN16.2
PWM3B: length 35.6
  Top Layer w0.381: CN16.1 5.5,88.67 14.59,79.58 19.08,79.58 21.88,76.78 21.88,74.47 26.08,70.27 TMS320F?.24
PWM4A: length 22.5
  Bottom Layer w0.381: CN3.2 18.88,80.16 26.15,72.9 26.15,70.29 27.4,69.04 29.58,69.04 TMS320F?.25
PWM4B: length 21.8
  Bottom Layer w0.381: TMS320F?.26 27.27,67.73 25.36,69.65 25.36,72.29 16.34,81.31 CN3.1
PWM5A: length 32.5
  Top Layer w0.381: CN4.2 8.03,80.71 16.09,72.64 20.13,72.64 26.35,66.42 29.47,66.42 30.69,65.19 TMS320F?.27
PWM5B: length 32.2
  Top Layer w0.381: CN4.1 5.49,81.32 15.07,71.73 19.52,71.73 26.05,65.19 TMS320F?.28
PWM6A: length 22
  Bottom Layer w0.381: CN5.2 18.68,71.48 20.89,69.27 20.89,66.07 23.02,63.93 29.6,63.93 TMS320F?.29
PWM6B: length 21.2
  Bottom Layer w0.381: TMS320F?.30 23.11,62.65 20.05,65.71 20.05,68.81 16.14,72.72 CN5.1
SCLA: length 72
  Bottom Layer w0.381: TMS320F?.64 79.33,47.41 80.57,46.18 82.81,46.18 85.91,49.28 85.91,104.52 89.11,107.72 H2.3
SDAA: length 66.1
  Bottom Layer w0.381: TMS320F?.63 81.87,47.41 85.05,50.59 85.05,104.98 86.57,106.5 H2.4

## Copper pours and planes (outline as drawn; the poured copper is in the pictures)
AGND on Bottom Layer: 28.44,54.25 48.66,54.25 83.4,19.9 83.4,-0.37 97.39,-0.37 97.39,123.39 -0.37,123.39 -0.37,61.95 20.74,61.95
GND on Bottom Layer: 48.46,53.92 83.03,19.36 83.03,-0.36 -0.58,-0.36 -0.58,61.65 20.15,61.65 27.87,53.92

## Text on the board
Bottom Silkscreen Layer: TMS320F28335转接板 V4.0
Top Silkscreen Layer: B5 | B3 | B1 | 13 | 17 | A5 | A3 | 16 | A1 | 12 | A4 | A2 | A6 | GND | 42 | 5V | B2 | B4 | 15 | B6 | 43 | 14 | A7 | AGND | 36 | 57 | 23 | 55 | 27 | 63 | 21 | 25 | 37 | 19 | 22 | 54 | 62 | 26 | 18 | 56 | 35 | 24 | 34 | 20 | 30 | 31 | 49 | 48 | 51 | 50 | 53 | B0 | 87 | 86 | 85 | A0 | 84 | B7 | TMS320F28335
